# Altium project MOD-COIL-LN2-21.PrjPCB (part 2 of 4)

## Sheet CPLD.SchDoc: =Project
size 420 x 297 mm; Author: G.Kasprowicz; CompanyName: WUT ISE; DrawnBy: G.Kasprowicz; Organization: WUT ISE; Address1: PW ISE; Address2: Nowowiejska 15/19 00-665 Warsaw; Address3: gkasprow@gmail.com; SheetNumber: 2; SheetTotal: 9; ModifiedBy: -; CheckedDate: -; Title2: CPLD; DivGrp: WUT ISE; Designer: G.Kasprowicz; SPICEModelCacheRYPVXPCY: <root> / <DocumentId>RYPVXPCY</DocumentId> / </root>; ModifiedDate: -; ProjectName: Sensor Box
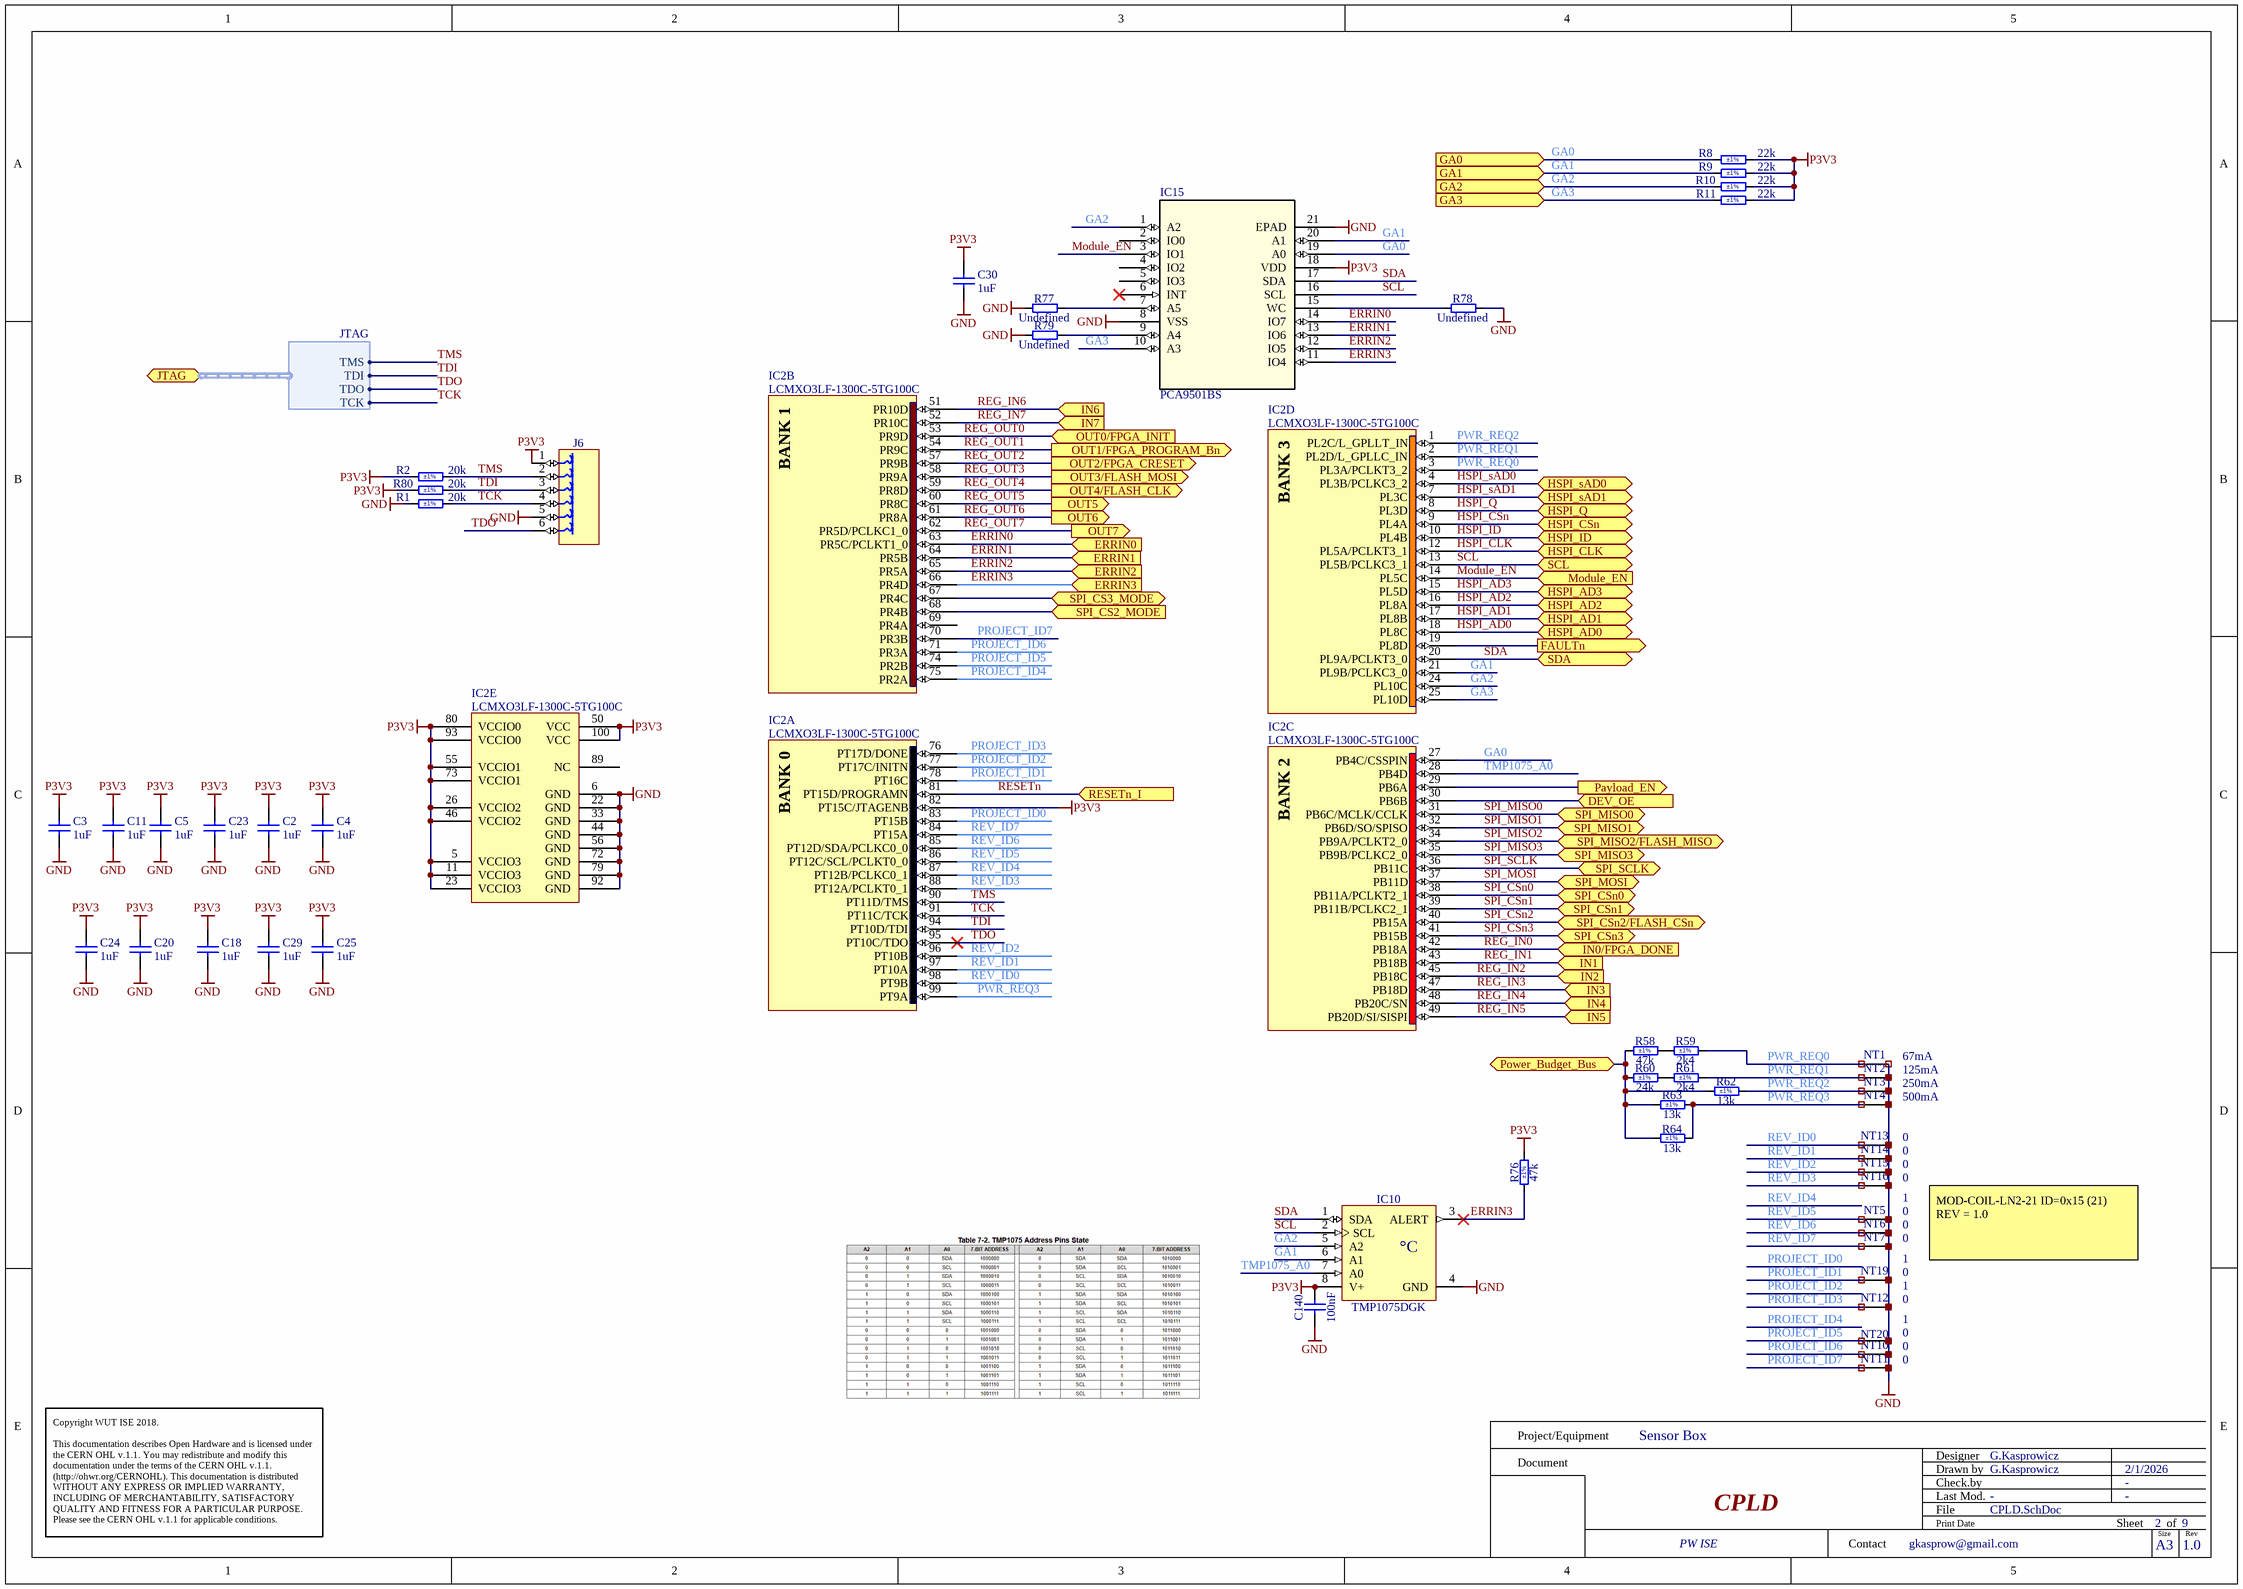
[diagram p2: CPLD.SchDoc]

### Parts
C2  1uF  [CAPC1005X55N]
C3  1uF  [CAPC1005X55N]
C4  1uF  [CAPC1005X55N]
C5  1uF  [CAPC1005X55N]
C11  1uF  [CAPC1005X55N]
C18  1uF  [CAPC1005X55N]
C20  1uF  [CAPC1005X55N]
C23  1uF  [CAPC1005X55N]
C24  1uF  [CAPC1005X55N]
C25  1uF  [CAPC1005X55N]
C29  1uF  [CAPC1005X55N]
C30  1uF  [CAPC1005X55N]
C140  100nF  [CAPC1005X55N]
IC2  LCMXO3LF-1300C-5TG100C  [QFP50P1600X1600X160-100N]  (parts A,B,C,D,E of 5)
IC10  TMP1075DGK  [SOP65P490X110-8N]
IC15  PCA9501BS  [HVQFN20_SOT662-1_5X5_NXP]
J6  TC2030-MCP  [TC2030-MCP]  (value not drawn)  (no BOM)
NT1  Net Tie  [Net Tie 3]  (value not drawn)  (net tie, no BOM)
NT2  Net Tie  [Net Tie 3]  (value not drawn)  (net tie, no BOM)
NT3  Net Tie  [Net Tie 3]  (value not drawn)  (net tie, no BOM)
NT4  Net Tie  [Net Tie 3]  (value not drawn)  (net tie, no BOM)
NT5  Net Tie  [Net Tie 3]  (value not drawn)  (net tie, no BOM)
NT6  Net Tie  [Net Tie 3]  (value not drawn)  (net tie, no BOM)
NT7  Net Tie  [Net Tie 3]  (value not drawn)  (net tie, no BOM)
NT10  Net Tie  [Net Tie 3]  (value not drawn)  (net tie, no BOM)
NT11  Net Tie  [Net Tie 3]  (value not drawn)  (net tie, no BOM)
NT12  Net Tie  [Net Tie 3]  (value not drawn)  (net tie, no BOM)
NT13  Net Tie  [Net Tie 3]  (value not drawn)  (net tie, no BOM)
NT14  Net Tie  [Net Tie 3]  (value not drawn)  (net tie, no BOM)
NT15  Net Tie  [Net Tie 3]  (value not drawn)  (net tie, no BOM)
NT16  Net Tie  [Net Tie 3]  (value not drawn)  (net tie, no BOM)
NT19  Net Tie  [Net Tie 3]  (value not drawn)  (net tie, no BOM)
NT20  Net Tie  [Net Tie 3]  (value not drawn)  (net tie, no BOM)
R1  20k  Tolerance: ±1%  [RESC1005X40N]
R2  20k  Tolerance: ±1%  [RESC1005X40N]
R8  22k  Tolerance: ±1%  [RESC1005X40N]
R9  22k  Tolerance: ±1%  [RESC1005X40N]
R10  22k  Tolerance: ±1%  [RESC1005X40N]
R11  22k  Tolerance: ±1%  [RESC1005X40N]
R58  47k  Tolerance: ±1%  [RESC1005X40N]
R59  2k4  Tolerance: ±1%  [RESC1005X40N]
R60  24k  Tolerance: ±1%  [RESC1005X40N]
R61  2k4  Tolerance: ±1%  [RESC1005X40N]
R62  13k  Tolerance: ±1%  [RESC1005X40N]
R63  13k  Tolerance: ±1%  [RESC1005X40N]
R64  13k  Tolerance: ±1%  [RESC1005X40N]
R76  47k  Tolerance: ±1%  [RESC1005X40N]
R77  Undefined  [RESC1005X40N]
R78  Undefined  [RESC1005X40N]
R79  Undefined  [RESC1005X40N]
R80  20k  Tolerance: ±1%  [RESC1005X40N]

### Ports
DEV_OE (in), ERRIN0 (in), ERRIN1 (in), ERRIN2 (in), ERRIN3 (in), FAULTn (out), GA0 (in), GA1 (in), GA2 (in), GA3 (in), HSPI_AD0 (bidir), HSPI_AD1 (bidir), HSPI_AD2 (bidir), HSPI_AD3 (bidir), HSPI_CLK (bidir), HSPI_CSn (bidir), HSPI_ID (bidir), HSPI_Q (bidir), HSPI_sAD0 (bidir), HSPI_sAD1 (bidir), IN0/FPGA_DONE (in), IN1 (in), IN2 (in), IN3 (in), IN4 (in), IN5 (in), IN6 (in), IN7 (in), JTAG (bidir, harness JTAG), Module_EN (in), OUT0/FPGA_INIT (in), OUT1/FPGA_PROGRAM_Bn (out), OUT2/FPGA_CRESET (out), OUT3/FLASH_MOSI (out), OUT4/FLASH_CLK (out), OUT5 (out), OUT6 (out), OUT7 (out), Payload_EN (out), Power_Budget_Bus (bidir), RESETn_I (in), SCL (bidir), SDA (bidir), SPI_CS2_MODE (in), SPI_CS3_MODE (bidir), SPI_CSn0 (bidir), SPI_CSn1 (bidir), SPI_CSn2/FLASH_CSn (bidir), SPI_CSn3 (bidir), SPI_MISO0 (bidir), SPI_MISO1 (bidir), SPI_MISO2/FLASH_MISO (bidir), SPI_MISO3 (bidir), SPI_MOSI (bidir), SPI_SCLK (bidir)

### Harnesses
JTAG: TMS, TDI, TDO, TCK

### Nets
GND: C2.1 C3.1 C4.1 C5.1 C11.1 C18.1 C20.1 C23.1 C24.1 C25.1 C29.1 C30.1 C140.1 IC2.6(GND) IC2.22(GND) IC2.33(GND) IC2.44(GND) IC2.56(GND) IC2.72(GND) IC2.79(GND) IC2.92(GND) IC10.4(GND) IC15.8(VSS) IC15.21(EPAD) J6.5 NT1.2 NT2.2 NT3.2 NT4.2 NT5.2 NT6.2 NT7.2 NT10.2 NT11.2 NT12.2 NT13.2 NT14.2 NT15.2 NT16.2 NT19.2 NT20.2 R1.2 R77.1 R78.2 R79.1
P3V3: C2.2 C3.2 C4.2 C5.2 C11.2 C18.2 C20.2 C23.2 C24.2 C25.2 C29.2 C30.2 C140.2 IC2.5(VCCIO3) IC2.11(VCCIO3) IC2.23(VCCIO3) IC2.26(VCCIO2) IC2.46(VCCIO2) IC2.50(VCC) IC2.55(VCCIO1) IC2.73(VCCIO1) IC2.80(VCCIO0) IC2.82(PT15C/JTAGENB) IC2.93(VCCIO0) IC2.100(VCC) IC10.8(V+) IC15.18(VDD) J6.1 R2.2 R8.1 R9.1 R10.1 R11.1 R76.2 R80.2
ERRIN0: IC2.63(PR5C/PCLKT1_0) IC15.14(IO7) ; port ERRIN0  [project net CH0_BOOST_FLT]
ERRIN1: IC2.64(PR5B) IC15.13(IO6) ; port ERRIN1  [project net CH1_BOOST_FLT]
ERRIN2: IC2.65(PR5A) IC15.12(IO5) ; port ERRIN2  [project net CH0_ERR]
ERRIN3: IC2.66(PR4D) IC10.3(ALERT) IC15.11(IO4) R76.1 ; port ERRIN3  [project net CH1_ERR]
FAULTn: IC2.19(PL8D) ; port FAULTn
GA0: IC2.27(PB4C/CSSPIN) IC15.19(A0) R8.2 ; port GA0
GA1: IC2.21(PL9B/PCLKC3_0) IC10.6(A1) IC15.20(A1) R9.2 ; port GA1
GA2: IC2.24(PL10C) IC10.5(A2) IC15.1(A2) R10.2 ; port GA2
GA3: IC2.25(PL10D) IC15.10(A3) R11.2 ; port GA3
HSPI_AD0: IC2.18(PL8C) ; port HSPI_AD0
HSPI_AD1: IC2.17(PL8B) ; port HSPI_AD1
HSPI_AD2: IC2.16(PL8A) ; port HSPI_AD2
HSPI_AD3: IC2.15(PL5D) ; port HSPI_AD3
HSPI_CLK: IC2.12(PL5A/PCLKT3_1) ; port HSPI_CLK
HSPI_CSn: IC2.9(PL4A) ; port HSPI_CSn
HSPI_ID: IC2.10(PL4B) ; port HSPI_ID
HSPI_Q: IC2.8(PL3D) ; port HSPI_Q
HSPI_sAD0: IC2.4(PL3B/PCLKC3_2) ; port HSPI_sAD0
HSPI_sAD1: IC2.7(PL3C) ; port HSPI_sAD1
Module_EN: IC2.14(PL5C) IC15.3(IO1) ; port Module_EN
Payload_EN: IC2.29(PB6A) ; port Payload_EN
PROJECT_ID0: IC2.83(PT15B)
PROJECT_ID1: IC2.78(PT16C) NT19.1
PROJECT_ID2: IC2.77(PT17C/INITN)
PROJECT_ID3: IC2.76(PT17D/DONE) NT12.1
PROJECT_ID4: IC2.75(PR2A)
PROJECT_ID5: IC2.74(PR2B) NT20.1
PROJECT_ID6: IC2.71(PR3A) NT10.1
PROJECT_ID7: IC2.70(PR3B) NT11.1
PWR_REQ0: IC2.3(PL3A/PCLKT3_2) NT1.1 R59.2
PWR_REQ1: IC2.2(PL2D/L_GPLLC_IN) NT2.1 R61.2
PWR_REQ2: IC2.1(PL2C/L_GPLLT_IN) NT3.1 R62.2
PWR_REQ3: IC2.99(PT9A) NT4.1 R63.2 R64.2
REG_IN0: IC2.42(PB18A) ; port IN0/FPGA_DONE
REG_IN1: IC2.43(PB18B) ; port IN1
REG_IN2: IC2.45(PB18C) ; port IN2
REG_IN3: IC2.47(PB18D) ; port IN3
REG_IN4: IC2.48(PB20C/SN) ; port IN4
REG_IN5: IC2.49(PB20D/SI/SISPI) ; port IN5
REG_IN6: IC2.51(PR10D) ; port IN6
REG_IN7: IC2.52(PR10C) ; port IN7
REG_OUT0: IC2.53(PR9D) ; port OUT0/FPGA_INIT
REG_OUT1: IC2.54(PR9C) ; port OUT1/FPGA_PROGRAM_Bn
REG_OUT2: IC2.57(PR9B) ; port OUT2/FPGA_CRESET
REG_OUT3: IC2.58(PR9A) ; port OUT3/FLASH_MOSI
REG_OUT4: IC2.59(PR8D) ; port OUT4/FLASH_CLK  [project net LED0]
REG_OUT5: IC2.60(PR8C) ; port OUT5  [project net LED1]
REG_OUT6: IC2.61(PR8A) ; port OUT6  [project net LED2]
REG_OUT7: IC2.62(PR5D/PCLKC1_0) ; port OUT7  [project net LED3]
RESETn: IC2.81(PT15D/PROGRAMN) ; port RESETn_I
REV_ID0: IC2.98(PT9B) NT13.1
REV_ID1: IC2.97(PT10A) NT14.1
REV_ID2: IC2.96(PT10B) NT15.1
REV_ID3: IC2.88(PT12A/PCLKT0_1) NT16.1
REV_ID4: IC2.87(PT12B/PCLKC0_1)
REV_ID5: IC2.86(PT12C/SCL/PCLKT0_0) NT5.1
REV_ID6: IC2.85(PT12D/SDA/PCLKC0_0) NT6.1
REV_ID7: IC2.84(PT15A) NT7.1
SCL: IC2.13(PL5B/PCLKC3_1) IC10.2(SCL) IC15.16(SCL) ; port SCL
SDA: IC2.20(PL9A/PCLKT3_0) IC10.1(SDA) IC15.17(SDA) ; port SDA
SPI_CSn0: IC2.38(PB11A/PCLKT2_1) ; port SPI_CSn0
SPI_CSn1: IC2.39(PB11B/PCLKC2_1) ; port SPI_CSn1
SPI_CSn2: IC2.40(PB15A) ; port SPI_CSn2/FLASH_CSn
SPI_CSn3: IC2.41(PB15B) ; port SPI_CSn3  [project net PWRMON_SPI_CSn]
SPI_MISO0: IC2.31(PB6C/MCLK/CCLK) ; port SPI_MISO0
SPI_MISO1: IC2.32(PB6D/SO/SPISO) ; port SPI_MISO1
SPI_MISO2: IC2.34(PB9A/PCLKT2_0) ; port SPI_MISO2/FLASH_MISO
SPI_MISO3: IC2.35(PB9B/PCLKC2_0) ; port SPI_MISO3  [project net PWRMON_SPI_Q]
SPI_MOSI: IC2.37(PB11D) ; port SPI_MOSI
SPI_SCLK: IC2.36(PB11C) ; port SPI_SCLK  [project net SPI_CLK]
TCK: IC2.91(PT11C/TCK) J6.4 R1.1 ; port JTAG.TCK
TDI: IC2.94(PT10D/TDI) J6.3 R80.1 ; port JTAG.TDI
TDO: IC2.95(PT10C/TDO) J6.6 ; port JTAG.TDO
TMP1075_A0: IC2.28(PB4D) IC10.7(A0)
TMS: IC2.90(PT11D/TMS) J6.2 R2.1 ; port JTAG.TMS
NetIC2_30: IC2.30(PB6B) ; port DEV_OE
NetIC2_67: IC2.67(PR4C) ; port SPI_CS3_MODE
NetIC2_68: IC2.68(PR4B) ; port SPI_CS2_MODE
NetIC15_7: IC15.7(A5) R77.2
NetIC15_9: IC15.9(A4) R79.2
NetIC15_15: IC15.15(WC) R78.1
NetJ1_B17: R58.1 R60.1 R62.1 R63.1 R64.1 ; port Power_Budget_Bus
NetR58_2: R58.2 R59.1
NetR60_2: R60.2 R61.1

Not connected (* = marked no-connect by the designer): IC2 69(PR4A) 89(NC); IC15 2(IO0) 4(IO2) 5(IO3) 6(INT)*

### Notes on the sheet
- 125mA
- 67mA
- 500mA
- 250mA
- 0
- 1
- MOD-COIL-LN2-21 ID=0x15 (21)
  REV = 1.0
- Project/Equipment
- Document
- Designer
- Drawn by
- Check.by
- Copyright WUT ISE 2018.
  This documentation describes Open Hardware and is licensed under the CERN OHL v.1.1. You may redistribute and modify this documentation under the terms of the CERN OHL v.1.1. (http://ohwr.org/CERNOHL). This documentation is distributed WITHOUT ANY EXPRESS OR IMPLIED WARRANTY, INCLUDING OF MERCHANTABILITY, SATISFACTORY QUALITY AND FITNESS FOR A PARTICULAR PURPOSE. Please see the CERN OHL v.1.1 for applicable conditions.
- Contact
- File
- Last Mod.
- Print Date
- Sheet
- Size
- A3
- of
- Rev
- (in symbol LCMXO3LF-1300C-5TG100C, part A) BANK 0
- (in symbol LCMXO3LF-1300C-5TG100C, part B) BANK 1
- (in symbol LCMXO3LF-1300C-5TG100C, part C) BANK 2
- (in symbol LCMXO3LF-1300C-5TG100C, part D) BANK 3
- (in symbol TMP1075DGK) °C

### Library data of the parts
C2-C5 C11 C18 C20 C23-C25 C29 C30 = CC0402_1UF_16V_10%_X5R: Non-polarised capacitor; Part Description: SMD Multilayer Chip Ceramic Capacitor; Manufacturer: GENERIC; Manufacturer1 Part Number: C1005X5R1C105KT; Voltage: 16V; TC: X5R; Tolerance: ±10%; Part Number: CC0402_1UF_16V_10%_X5R; Component Kind: Standard; Component Type: Standard; Pin Count: 2; Value: 1uF; Status: Preferred; Manufacturer Part Number: CC0402_1UF_16V_10%_X5R; Case: 0402; Mounted: Yes; Socket: No; SMD: Yes; Sense: No; Manufacturer1 Example: TDK; Manufacturer1 ComponentHeight: 0.55mm; HelpURL: \\cern.ch\dfs\Applications\Altium\Datasheets\CC0402_X5R_TDK_C.pdf; Author: CERN DEM JLC; CreateDate: 25.10.2012; LatestRevisionDate: 25.10.2012
C140 = CC0402_100NF_16V_10%_X7R: Non-polarised capacitor; Part Description: SMD Multilayer Chip Ceramic Capacitor; Manufacturer: GENERIC; Manufacturer1 Part Number: GRM155R71C104KA88D; Voltage: 16V; TC: X7R; Tolerance: ±10%; Part Number: CC0402_100NF_16V_10%_X7R; Component Kind: Standard; Component Type: Standard; Pin Count: 2; Value: 100nF; Status: Not Recommended; Manufacturer Part Number: CC0402_100NF_16V_10%_X7R; Case: 0402; Mounted: Yes; Socket: No; SMD: Yes; Sense: No; Manufacturer1 Example: MURATA; Manufacturer1 ComponentHeight: 0.55mm; HelpURL: \\cern.ch\dfs\Applications\Altium\Datasheets\CC0402_X7R_MURATA_GRM.pdf; Author: CERN DEM JLC; CreateDate: 05.12.2013; LatestRevisionDate: 03.12.2007
IC2 = LCMXO3LF-1300C-5TG100C: MachXO2, 2.5V/3.3V High-Performance 2000 Macrocell CPLD, 80 I/Os, 100-Pin TQFP, Speed Grade 4, Industrial Grade; Part Description: MachXO3LF, 2.5V/3.3V Low-Density Ultra-Low Power FPGA, 1300 LUTs, 80 I/Os, 100-Pin TQFP, Speed Grade 5, Commercial Grade; Manufacturer: LATTICE SEMICONDUCTOR; PressFit: No; Bonding: No; Part Number: LCMXO3LF-1300C-5TG100C; Component Kind: Standard; Component Type: Standard; Device: LCMXO3LF-1300C-5TG100C; PackageDescription: QFP, 0.50mm Pitch, Square; 100 Pin, 14.0mm L X 14.0mm W X 1.60mm H body, IPC Medium Density; Manufacturer Part Number: LCMXO3LF-1300C-5TG100C; Pin Count: 100; Case: QFP100; Mounted: Yes; Socket: No; SMD: Yes; Sense: No; ComponentHeight: 1.6mm; HelpURL: \\cern.ch\dfs\Applications\Altium\Datasheets\LCMXO3LF_Serie.pdf; ComponentLink1URL: \\cern.ch\dfs\Applications\Altium\Datasheets\LATTICE_Package.pdf; ComponentLink1Description: Package Drawing; ComponentLink2URL: \\cern.ch\dfs\Applications\Altium\Datasheets\LCMXO3LF-1300C-5TG100_Pinout.pdf; ComponentLink2Description: Pinout; Author: CERN DEM MR; CreateDate: 18.06.2019; LatestRevisionDate: 18.06.2019
IC10 = TMP1075DGK: High Accuracy Temperature Sensor With I2C and SMBus Interface in Industry Standard LM75; Manufacturer: TEXAS INSTRUMENTS; PressFit: No; Bonding: No; Part Number: TMP1075DGK; Component Kind: Standard; Component Type: Standard; Device: TMP1075DGK; PackageDescription: SOP, 0.65mm Pitch; 8 Pin, 3.00mm W X 3.00mm L X 1.10mm H body, IPC Medium Density; Part Description: High Accuracy Temperature Sensor with I2C and SMBus Interface in Industry Standard LM75; Manufacturer Part Number: TMP1075DGK; Pin Count: 8; Case: uSOP8; Mounted: Yes; Socket: No; SMD: Yes; Sense: No; ComponentHeight: 1.1mm; HelpURL: \\cern.ch\dfs\Applications\Altium\Datasheets\TMP1075DGK.pdf; Author: CERN DEM MR; CreateDate: 04.10.2019; LatestRevisionDate: 04.10.2019
IC15 = IFC_PCA9501BS: 8-bit I2C-bus and SMBus I/O port with interrupt, 2-kbit / EEPROM and 6 address pins; Manufacturer: NXP; Manufacturer Part Number: PCA9501BS,118; Part Number: PCA9501BS
J6 = TC2030-MCP: TC2030-MCP and TC2030-MCP-NL Pad Contact; Part Description: 6 X 31mil Diameter SMD Pad For TC2030-MCP Legged Connector; Mounted: No; Part Number: TC2030-MCP; Component Type: Standard (No BOM); Pin Count: 6; Family: TC2030-MCP; Socket: No; SMD: Yes; Sense: No; Status: None; ComponentHeight: 0mm; HelpURL: \\cern.ch\dfs\Applications\Altium\Datasheets\TC2030-MCP.pdf; Author: CERN DEM HF; CreateDate: 27.03.2023; LatestRevisionDate: 27.03.2023; PackageDescription: 6 X 31mil Diameter SMD Pad For TC2030-MCP Legged Connector
NT1-NT7 NT10-NT16 NT19 NT20 = Net Tie 3: Part Description: Net Tie (2 Nets); Mounted: No; Part Number: Net Tie 3; Component Type: Net Tie; Pin Count: 2; Family: Net Tie; Socket: No; SMD: No; Sense: No; Status: None; ComponentHeight: 0mm; HelpURL: Undefined; Author: CERN DEM HF; CreateDate: 23.09.2024; LatestRevisionDate: 23.09.2024; PackageDescription: SMD Net Tie
R1 R2 R80 = R0402_20K_1%_0.0625W_100PPM: Resistor - 1%; Part Description: General Purpose Thick Film Chip Resistor; Manufacturer: GENERIC; Manufacturer1 Part Number: 232270672003L; TC: ±100ppm/°C; PressFit: No; Part Number: R0402_20K_1%_0.0625W_100PPM; Component Kind: Standard; Component Type: Standard; Pin Count: 2; Value: 20k; Status: Not Recommended; Power: 0.0625W; Manufacturer Part Number: R0402_20K_1%_0.0625W_100PPM; Case: 0402; Mounted: Yes; Sense: No; Socket: No; SMD: Yes; Manufacturer1 Example: YAGEO PHYCOMP; Manufacturer1 ComponentHeight: 0.4mm; HelpURL: \\cern.ch\dfs\Applications\Altium\Datasheets\R0402_Phycomp_RC0402.pdf; Author: CERN DEM JLC; CreateDate: 03.12.2007; LatestRevisionDate: 17.10.2012
R8-R11 = R0402_22K_1%_0.0625W_100PPM: Resistor - 1%; Part Description: General Purpose Thick Film Chip Resistor; Manufacturer: GENERIC; Manufacturer1 Part Number: 232270672203L; TC: ±100ppm/°C; PressFit: No; Part Number: R0402_22K_1%_0.0625W_100PPM; Component Kind: Standard; Component Type: Standard; Pin Count: 2; Value: 22k; Status: Not Recommended; Power: 0.0625W; Manufacturer Part Number: R0402_22K_1%_0.0625W_100PPM; Case: 0402; Mounted: Yes; Sense: No; Socket: No; SMD: Yes; Manufacturer1 Example: YAGEO PHYCOMP; Manufacturer1 ComponentHeight: 0.4mm; HelpURL: \\cern.ch\dfs\Applications\Altium\Datasheets\R0402_Phycomp_RC0402.pdf; Author: CERN DEM JLC; CreateDate: 03.12.2007; LatestRevisionDate: 17.10.2012
R58 R76 = R0402_47K_1%_0.0625W_100PPM: Resistor - 1%; Part Description: General Purpose Thick Film Chip Resistor; Manufacturer: GENERIC; Manufacturer1 Part Number: 232270674703L; TC: ±100ppm/°C; PressFit: No; Part Number: R0402_47K_1%_0.0625W_100PPM; Component Kind: Standard; Component Type: Standard; Pin Count: 2; Value: 47k; Status: Not Recommended; Power: 0.0625W; Manufacturer Part Number: R0402_47K_1%_0.0625W_100PPM; Case: 0402; Mounted: Yes; Sense: No; Socket: No; SMD: Yes; Manufacturer1 Example: YAGEO PHYCOMP; Manufacturer1 ComponentHeight: 0.4mm; HelpURL: \\cern.ch\dfs\Applications\Altium\Datasheets\R0402_Phycomp_RC0402.pdf; Author: CERN DEM JLC; CreateDate: 03.12.2007; LatestRevisionDate: 17.10.2012
R59 R61 = R0402_2K4_1%_0.0625W_100PPM: Resistor - 1%; Part Description: General Purpose Thick Film Chip Resistor; Manufacturer: GENERIC; Manufacturer1 Part Number: 232270672402L; TC: ±100ppm/°C; PressFit: No; Part Number: R0402_2K4_1%_0.0625W_100PPM; Component Kind: Standard; Component Type: Standard; Pin Count: 2; Value: 2k4; Status: Not Recommended; Power: 0.0625W; Manufacturer Part Number: R0402_2K4_1%_0.0625W_100PPM; Case: 0402; Mounted: Yes; Sense: No; Socket: No; SMD: Yes; Manufacturer1 Example: YAGEO PHYCOMP; Manufacturer1 ComponentHeight: 0.4mm; HelpURL: \\cern.ch\dfs\Applications\Altium\Datasheets\R0402_Phycomp_RC0402.pdf; Author: CERN DEM JLC; CreateDate: 03.12.2007; LatestRevisionDate: 17.10.2012
R60 = R0402_24K_1%_0.0625W_100PPM: Resistor - 1%; Part Description: General Purpose Thick Film Chip Resistor; Manufacturer: GENERIC; Manufacturer1 Part Number: 232270672403L; TC: ±100ppm/°C; PressFit: No; Part Number: R0402_24K_1%_0.0625W_100PPM; Component Kind: Standard; Component Type: Standard; Pin Count: 2; Value: 24k; Status: Not Recommended; Power: 0.0625W; Manufacturer Part Number: R0402_24K_1%_0.0625W_100PPM; Case: 0402; Mounted: Yes; Sense: No; Socket: No; SMD: Yes; Manufacturer1 Example: YAGEO PHYCOMP; Manufacturer1 ComponentHeight: 0.4mm; HelpURL: \\cern.ch\dfs\Applications\Altium\Datasheets\R0402_Phycomp_RC0402.pdf; Author: CERN DEM JLC; CreateDate: 03.12.2007; LatestRevisionDate: 17.10.2012
R62-R64 = R0402_13K_1%_0.0625W_100PPM: Resistor - 1%; Part Description: General Purpose Thick Film Chip Resistor; Manufacturer: GENERIC; Manufacturer1 Part Number: 232270671303L; TC: ±100ppm/°C; PressFit: No; Part Number: R0402_13K_1%_0.0625W_100PPM; Component Kind: Standard; Component Type: Standard; Pin Count: 2; Value: 13k; Status: Not Recommended; Power: 0.0625W; Manufacturer Part Number: R0402_13K_1%_0.0625W_100PPM; Case: 0402; Mounted: Yes; Sense: No; Socket: No; SMD: Yes; Manufacturer1 Example: YAGEO PHYCOMP; Manufacturer1 ComponentHeight: 0.4mm; HelpURL: \\cern.ch\dfs\Applications\Altium\Datasheets\R0402_Phycomp_RC0402.pdf; Author: CERN DEM JLC; CreateDate: 03.12.2007; LatestRevisionDate: 17.10.2012
R77-R79 = R0402_NO-VALUE: Resistor; Part Description: Reserved Footprint For a 0402 (1005) Chip Resistor; PressFit: No; Mounted: No; Part Number: R0402_NO-VALUE; Component Kind: Standard; Component Type: Standard; Pin Count: 2; Value: Undefined; Status: None; Manufacturer: Undefined; Manufacturer Part Number: R0402_NO-VALUE; Case: 0402; Sense: No; Socket: No; SMD: Yes; Manufacturer1 Example: Undefined; Manufacturer1 Part Number: Undefined; Manufacturer1 ComponentHeight: Undefined; HelpURL: Undefined; Author: CERN DEM JLC; CreateDate: 03.12.2007; LatestRevisionDate: 13.03.2008

## Sheet FPGA.SchDoc: FPGA
size A3; Author: M.Beldyga; CompanyName: WUT ISE; DrawnBy: M.Beldyga; Organization: WUT ISE; Address1: PW ISE; Address2: Nowowiejska 15/19 00-665 Warsaw; Address3: micbeldyga@gmail.com; SheetNumber: 4; SheetTotal: 9; ModifiedBy: -; CheckedDate: -; DivGrp: WUT ISE; Designer: M.Beldyga; ModifiedDate: -; ProjectName: Sensor Box
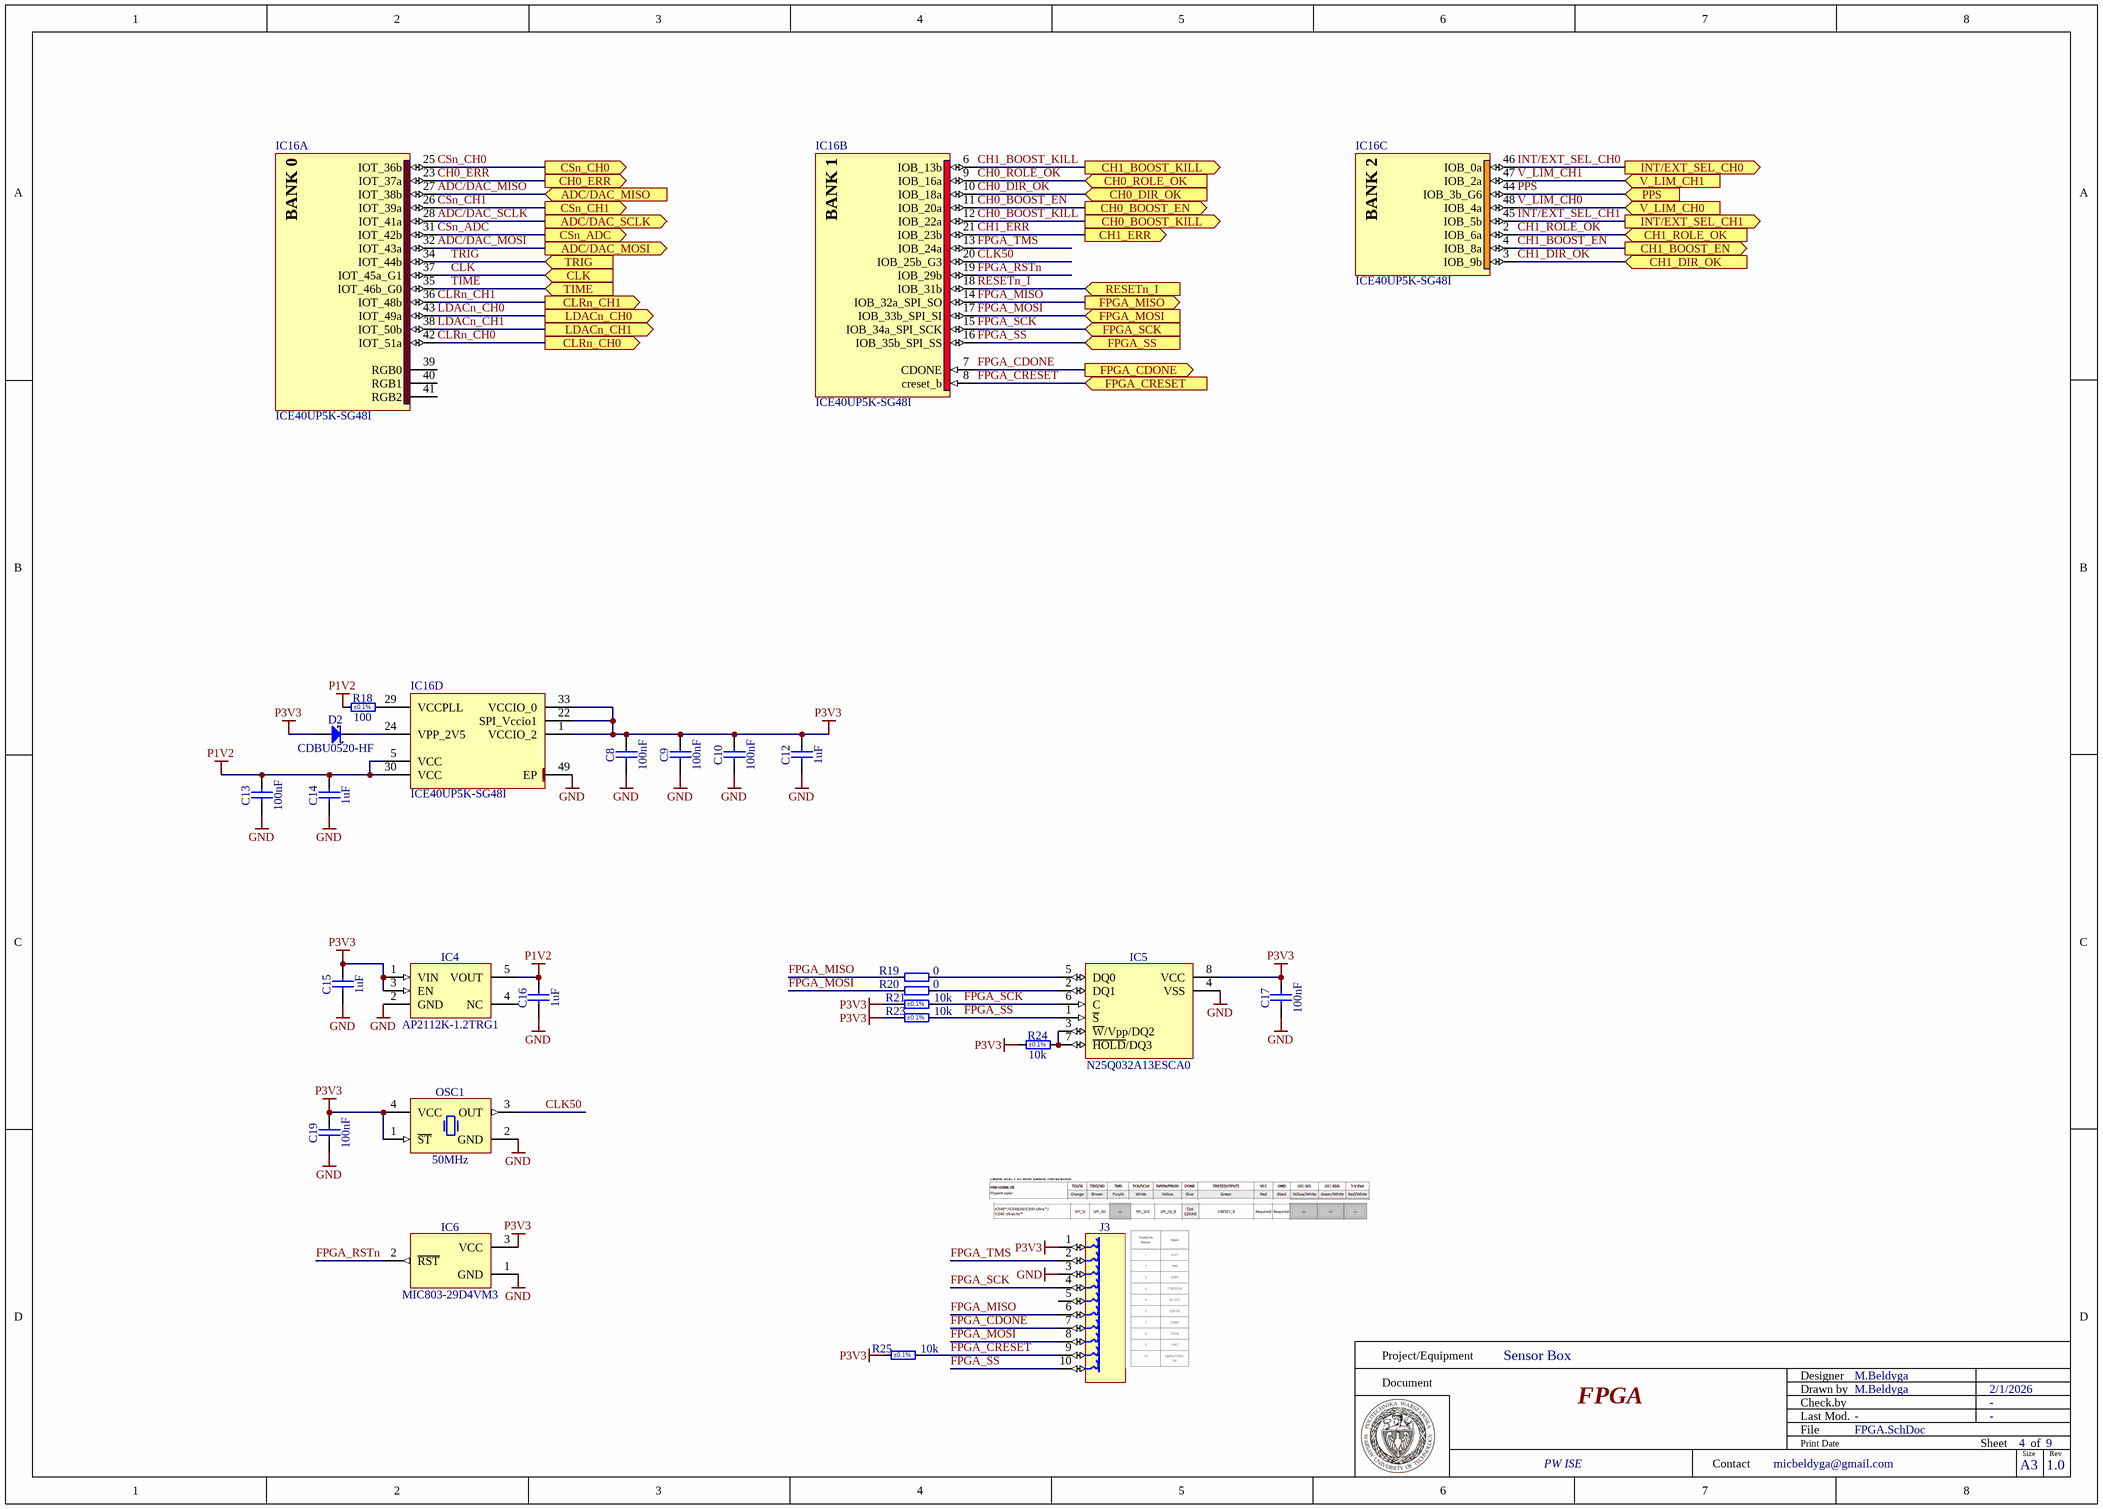
[diagram p3: FPGA.SchDoc]

### Parts
C8  100nF  [CAPC1005X55N]
C9  100nF  [CAPC1005X55N]
C10  100nF  [CAPC1005X55N]
C12  1uF  [CAPC1005X55N]
C13  100nF  [CAPC1005X55N]
C14  1uF  [CAPC1005X55N]
C15  1uF  [CAPC1005X55N]
C16  1uF  [CAPC1005X55N]
C17  100nF  [CAPC1005X55N]
C19  100nF  [CAPC1005X55N]
D2  CDBU0520-HF  [SOD-523F]
IC4  AP2112K-1.2TRG1  [SOT95P285X140-5N]
IC5  N25Q032A13ESCA0  [SOIC127P600X175-8N]
IC6  MIC803-29D4VM3  [SOT95P237X112-3N]
IC16  ICE40UP5K-SG48I  [QFN50P700X700X100-49N-S550]  (parts A,B,C,D of 4)
J3  TC2050-IDC  [TC2050-IDC]  (value not drawn)
OSC1  50MHz  [OSC_EPSON_SG-310]
R18  100  Tolerance: ±0.1%  [RESC1005X35N]
R19  0  [RESC1005X40N]
R20  0  [RESC1005X40N]
R21  10k  Tolerance: ±0.1%  [RESC1005X35N]
R23  10k  Tolerance: ±0.1%  [RESC1005X35N]
R24  10k  Tolerance: ±0.1%  [RESC1005X35N]
R25  10k  Tolerance: ±0.1%  [RESC1005X35N]

### Ports
ADC/DAC_MISO (in), ADC/DAC_MOSI (out), ADC/DAC_SCLK (out), CH0_BOOST_EN (out), CH0_BOOST_KILL (out), CH0_DIR_OK (in), CH0_ERR (out), CH0_ROLE_OK (in), CH1_BOOST_EN (out), CH1_BOOST_KILL (out), CH1_DIR_OK (in), CH1_ERR (out), CH1_ROLE_OK (in), CLK (in), CLRn_CH0 (out), CLRn_CH1 (out), CSn_ADC (out), CSn_CH0 (out), CSn_CH1 (out), FPGA_CDONE (out), FPGA_CRESET (in), FPGA_MISO (out), FPGA_MOSI (in), FPGA_SCK (in), FPGA_SS (in), INT/EXT_SEL_CH0 (out), INT/EXT_SEL_CH1 (out), LDACn_CH0 (out), LDACn_CH1 (out), PPS (in), RESETn_I (in), TIME (in), TRIG (in), V_LIM_CH0 (in), V_LIM_CH1 (in)

### Nets
GND: C8.1 C9.1 C10.1 C12.1 C13.1 C14.1 C15.1 C16.1 C17.1 C19.1 IC4.2(GND) IC5.4(VSS) IC6.1(GND) IC16.49(EP) J3.3 OSC1.2(GND)
P1V2: C13.2 C14.2 C16.2 IC4.5(VOUT) IC16.5(VCC) IC16.30(VCC) R18.1
P3V3: C8.2 C9.2 C10.2 C12.2 C15.2 C17.2 C19.2 D2.2(A) IC4.1(VIN) IC4.3(EN) IC5.8(VCC) IC6.3(VCC) IC16.1(VCCIO_2) IC16.22(SPI_Vccio1) IC16.33(VCCIO_0) J3.1 OSC1.1(~{ST}) OSC1.4(VCC) R21.1 R23.1 R24.1 R25.1
ADC/DAC_MISO: IC16.27(IOT_38b) ; port ADC/DAC_MISO
ADC/DAC_MOSI: IC16.32(IOT_43a) ; port ADC/DAC_MOSI
ADC/DAC_SCLK: IC16.28(IOT_41a) ; port ADC/DAC_SCLK
CH0_BOOST_EN: IC16.11(IOB_20a) ; port CH0_BOOST_EN  [project net BOOSTER_EN]
CH0_BOOST_KILL: IC16.12(IOB_22a) ; port CH0_BOOST_KILL  [project net BOOSTER_KILL]
CH0_DIR_OK: IC16.10(IOB_18a) ; port CH0_DIR_OK
CH0_ERR: IC16.23(IOT_37a) ; port CH0_ERR
CH0_ROLE_OK: IC16.9(IOB_16a) ; port CH0_ROLE_OK
CH1_BOOST_EN: IC16.4(IOB_8a) ; port CH1_BOOST_EN  [project net BOOSTER_EN]
CH1_BOOST_KILL: IC16.6(IOB_13b) ; port CH1_BOOST_KILL  [project net BOOSTER_KILL]
CH1_DIR_OK: IC16.3(IOB_9b) ; port CH1_DIR_OK
CH1_ERR: IC16.21(IOB_23b) ; port CH1_ERR
CH1_ROLE_OK: IC16.2(IOB_6a) ; port CH1_ROLE_OK
CLK: IC16.37(IOT_45a_G1) ; port CLK
CLK50: IC16.20(IOB_25b_G3) OSC1.3(OUT)
CLRn_CH0: IC16.42(IOT_51a) ; port CLRn_CH0  [project net CLRn_0]
CLRn_CH1: IC16.36(IOT_48b) ; port CLRn_CH1  [project net CLRn_1]
CSn_ADC: IC16.31(IOT_42b) ; port CSn_ADC  [project net CSn_2]
CSn_CH0: IC16.25(IOT_36b) ; port CSn_CH0  [project net CSn_0]
CSn_CH1: IC16.26(IOT_39a) ; port CSn_CH1  [project net CSn_1]
FPGA_CDONE: IC16.7(CDONE) J3.7 ; port FPGA_CDONE
FPGA_CRESET: IC16.8(creset_b) J3.9 R25.2 ; port FPGA_CRESET
FPGA_MISO: IC16.14(IOB_32a_SPI_SO) J3.6 R19.1 ; port FPGA_MISO
FPGA_MOSI: IC16.17(IOB_33b_SPI_SI) J3.8 R20.1 ; port FPGA_MOSI
FPGA_RSTn: IC6.2(~{RST}) IC16.19(IOB_29b)
FPGA_SCK: IC5.6(C) IC16.15(IOB_34a_SPI_SCK) J3.4 R21.2 ; port FPGA_SCK
FPGA_SS: IC5.1(~{S}) IC16.16(IOB_35b_SPI_SS) J3.10 R23.2 ; port FPGA_SS
FPGA_TMS: IC16.13(IOB_24a) J3.2
INT/EXT_SEL_CH0: IC16.46(IOB_0a) ; port INT/EXT_SEL_CH0
INT/EXT_SEL_CH1: IC16.45(IOB_5b) ; port INT/EXT_SEL_CH1
LDACn_CH0: IC16.43(IOT_49a) ; port LDACn_CH0  [project net LDACn_0]
LDACn_CH1: IC16.38(IOT_50b) ; port LDACn_CH1  [project net LDACn_1]
PPS: IC16.44(IOB_3b_G6) ; port PPS
RESETn_I: IC16.18(IOB_31b) ; port RESETn_I  [project net RESETn]
TIME: IC16.35(IOT_46b_G0) ; port TIME
TRIG: IC16.34(IOT_44b) ; port TRIG
V_LIM_CH0: IC16.48(IOB_4a) ; port V_LIM_CH0
V_LIM_CH1: IC16.47(IOB_2a) ; port V_LIM_CH1
NetD2_1: D2.1(C) IC16.24(VPP_2V5)
NetIC5_2: IC5.2(DQ1) R20.2
NetIC5_3: IC5.3(~{W}/Vpp/DQ2) IC5.7(~{HOLD}/DQ3) R24.2
NetIC5_5: IC5.5(DQ0) R19.2
NetIC16_29: IC16.29(VCCPLL) R18.2

Not connected (* = marked no-connect by the designer): IC4 4(NC); IC16 39(RGB0) 40(RGB1) 41(RGB2); J3 5

### Notes on the sheet
- Project/Equipment
- Document
- Designer
- Drawn by
- Check.by
- Contact
- File
- Last Mod.
- Print Date
- Sheet
- Size
- A3
- of
- Rev
- (in symbol ICE40UP5K-SG48I, part A) BANK 0
- (in symbol ICE40UP5K-SG48I, part B) BANK 1
- (in symbol ICE40UP5K-SG48I, part C) BANK 2

### Library data of the parts
C8-C10 C13 C17 C19 = CC0402_100NF_16V_10%_X7R: as C140 on sheet CPLD; Part Number: CC0402_100NF_16V_10%_X7R; Component Kind: Standard; Component Type: Standard; Pin Count: 2; Value: 100nF; Status: Not Recommended; Manufacturer Part Number: CC0402_100NF_16V_10%_X7R; Case: 0402; Mounted: Yes; Socket: No; SMD: Yes; Sense: No; Manufacturer1 Example: MURATA; Manufacturer1 ComponentHeight: 0.55mm; HelpURL: \\cern.ch\dfs\Applications\Altium\Datasheets\CC0402_X7R_MURATA_GRM.pdf; Author: CERN DEM JLC; CreateDate: 05.12.2013; LatestRevisionDate: 03.12.2007
C12 C14-C16 = CC0402_1UF_16V_10%_X5R: as C2 on sheet CPLD; Part Number: CC0402_1UF_16V_10%_X5R; Component Kind: Standard; Component Type: Standard; Pin Count: 2; Value: 1uF; Status: Preferred; Manufacturer Part Number: CC0402_1UF_16V_10%_X5R; Case: 0402; Mounted: Yes; Socket: No; SMD: Yes; Sense: No; Manufacturer1 Example: TDK; Manufacturer1 ComponentHeight: 0.55mm; HelpURL: \\cern.ch\dfs\Applications\Altium\Datasheets\CC0402_X5R_TDK_C.pdf; Author: CERN DEM JLC; CreateDate: 25.10.2012; LatestRevisionDate: 25.10.2012
D2 = CDBU0520-HF: Schottky Diode; Part Description: 20V Surface mount Schottky Barrier Diode; Manufacturer: COMCHIP; Voltage: 20V; Power: 500mA; PressFit: No; Bonding: No; Part Number: CDBU0520-HF; Component Kind: Standard; Component Type: Standard; Device: CDBU0520-HF; PackageDescription: Small Outline Diode Flat Lead (SOD-523F), Body; 1.80mm L X 1mm W X 0.85mm H; Manufacturer Part Number: CDBU0520-HF; Pin Count: 2; Case: SOD-523F; Mounted: Yes; Socket: No; SMD: Yes; Sense: No; ComponentHeight: 1mm; HelpURL: \\cern.ch\dfs\Applications\Altium\Datasheets\CDBU0520-HF.pdf; Author: CERN DEM HF; CreateDate: 13.10.2023; LatestRevisionDate: 13.10.2023
IC4 = REG_AP2112K-1.2: 600mA CMOS Low Dropout Linear Regulator with Enable; Part Description: 1.2V 600mA CMOS Low Dropout Linear Regulator with Enable; Manufacturer: DIODES INCORPORATED; PressFit: No; Bonding: No; Part Number: AP2112K-1.2TRG1; Component Kind: Standard; Component Type: Standard; Device: AP2112K-1.2TRG1; PackageDescription: SOT23, 0.95mm Pitch; 5 Pin, 1.6mm W X 3.0mm L X 1.40mm H body, IPC Medium Density; Manufacturer Part Number: AP2112K-1.2TRG1; Pin Count: 5; Case: SOT25; Mounted: Yes; Socket: No; SMD: Yes; Sense: No; ComponentHeight: 1.4mm; HelpURL: \\cern.ch\dfs\Applications\Altium\Datasheets\AP2112K-3.3TRG1.pdf; Author: GK; CreateDate: 13.12.2017; LatestRevisionDate: 27.06.2022
IC5 = N25Q032A13ESCA0: 32Mb, 3V, Multiple I/O Serial Flash Memory; Part Description: 32Mb, 2.7 to 3.6V, Multiple I/O Serial Flash Memory; Manufacturer: MICRON TECHNOLOGY; PressFit: No; Bonding: No; Part Number: N25Q032A13ESCA0; Component Kind: Standard; Component Type: Standard; Device: N25Q032A13ESCA0; PackageDescription: SOIC, 1.27mm Pitch; 8 Pin - Body 4x5mm, IPC Medium Density; Manufacturer Part Number: N25Q032A13ESCA0; Pin Count: 8; Case: SOIC8; Mounted: Yes; Socket: No; SMD: Yes; Sense: No; ComponentHeight: 1.75mm; HelpURL: \\cern.ch\dfs\Applications\Altium\Datasheets\N25Q032A13ESCA0.pdf; Author: CERN DEM HF; CreateDate: 09.12.2024; LatestRevisionDate: 09.12.2024
IC6 = MIC803-29D4VM3: 3.075V Microprocessor Supervisor Circuit With Open-Drain Reset Output; Part Description: 2.93V Microprocessor Supervisor Circuit with Open-Drain Reset Output; Manufacturer: MICROCHIP TECHNOLOGY; PressFit: No; Bonding: No; Part Number: MIC803-29D4VM3; Component Kind: Standard; Component Type: Standard; Device: MIC803-29D4VM3; PackageDescription: SOT, 0.95mm Pitch; 3 Pin, 1.30mm W X 2.92mm L X 1.12mm H body, IPC Medium Density; Manufacturer Part Number: MIC803-29D4VM3; Pin Count: 3; Case: SOT23-3; Mounted: Yes; Socket: No; SMD: Yes; Sense: No; ComponentHeight: 1.12mm; Author: CERN DEM BC; HelpURL: \\cern.ch\dfs\Applications\Altium\Datasheets\MIC803.pdf; CreateDate: 29.04.2020; LatestRevisionDate: 29.04.2020
IC16 = ICE40UP5K-SG48I: ICE40 Ultra FPGA, 3520 Logic Cells, 400 kHz Data Transfer Speed, 48 pin QFN; Part Description: ICE40 Ultra FPGA, 5280 Logic Cells, 400 kHz Data Transfer Speed, 48 pin QFN; Manufacturer: LATTICE SEMICONDUCTOR; PressFit: No; Bonding: No; Part Number: ICE40UP5K-SG48I; Component Kind: Standard; Component Type: Standard; Device: ICE40UP5K-SG48I; PackageDescription: QFN, 0.50mm Pitch, Square; 48 Pin, 7.00mm L X 7.00mm W X 1.00mm H body (w/Thermal Tab 5.50mm X 5.40mm), IPC Medium Density; Manufacturer Part Number: ICE40UP5K-SG48I; Pin Count: 49; Case: QFN48; Mounted: Yes; Socket: No; SMD: Yes; Sense: No; ComponentHeight: 1.00mm; HelpURL: \\cern.ch\dfs\Applications\Altium\Datasheets\ICE40UP5K.pdf; ComponentLink1URL: \\cern.ch\dfs\Applications\Altium\Datasheets\LATTICE_Packege.pdf; ComponentLink1Description: Package; ComponentLink2URL: \\cern.ch\dfs\Applications\Altium\Datasheets\ICE40UP5K_Pinout.xlsx; ComponentLink2Description: Pinout; Author: CERN DEM HF; CreateDate: 12/16/2024; LatestRevisionDate: 12/16/2024
J3 = TC2050-IDC: TC2030-MCP and TC2050-IDC Pad Contact; Part Description: 10 X 31mil Diameter SMD Pad For TC2050-IDC Legged Connector; Mounted: No; Part Number: TC2050-IDC; Component Kind: Standard (No BOM); Component Type: Standard (No BOM); Pin Count: 10; Family: TC2050-IDC; Socket: No; SMD: Yes; Sense: No; Status: None; ComponentHeight: 0mm; HelpURL: \\cern.ch\dfs\Applications\Altium\Datasheets\TC2050-IDC.pdf; Author: CERN DEM HF; CreateDate: 02.05.2024; LatestRevisionDate: 02.05.2024; PackageDescription: 10 X 31mil Diameter SMD Pad For TC2030-MCP Legged Connector
OSC1 = OSC_50MHZ_EPSON_SG-310SCN: Oscillator 4 pins 1=\ST 2=GND 3=OUT 4=VCC; Part Description: 3.3V, ±100ppm, 15pF -40..85°C, Stanby Function , Surface Mount Crystal Oscillator (SG-310 Series); Manufacturer: EPSON TOYOCOM; Manufacturer Part Number: SG-310 SCN 50.0000MJ; PressFit: No; Bonding: No; Part Number: OSC_50MHZ_EPSON_SG-310SCN; Component Kind: Standard; Component Type: Standard; PackageDescription: Oscillator, Corner Concave; 4 Pin, 2.5mm L X 3.2mm W X 1.2mm H; Value: 50MHz; Pin Count: 4; Mounted: Yes; Socket: No; SMD: Yes; Sense: No; ComponentHeight: 1.2mm; HelpURL: \\cern.ch\dfs\Applications\Altium\Datasheets\OSC_EPSON_SG-310.pdf; ComponentLink1URL: \\cern.ch\dfs\Applications\Altium\Datasheets\OSC_EPSON_SG-310_Ordering-Informations.pdf; ComponentLink1Description: Ordering Informations; Author: CERN DEM JLC; CreateDate: 31.03.2010; LatestRevisionDate: 31.03.2010
R18 = R0402_100R_0.1%_0.063W_25PPM: Resistor - 0.1%; Part Description: Thin Film Precision Resistor; Manufacturer: GENERIC; Manufacturer1 Part Number: CPF0402B100RE1; Power: 0.063W; TC: ±25ppm/°C; PressFit: No; Part Number: R0402_100R_0.1%_0.063W_25PPM; Component Kind: Standard; Component Type: Standard; Pin Count: 2; Value: 100; Status: Not Recommended; Manufacturer Part Number: R0402_100R_0.1%_0.063W_25PPM; Case: 0402; Mounted: Yes; Sense: No; Socket: No; SMD: Yes; Manufacturer1 Example: TE CONNECTIVITY; Manufacturer1 ComponentHeight: 0.35mm; HelpURL: \\cern.ch\dfs\Applications\Altium\Datasheets\R0402_TYCO_CPF.pdf; Author: CERN DEM JMW; CreateDate: 22.09.2015; LatestRevisionDate: 22.09.2015
R19 R20 = R0402_0R_JUMPER: Resistor; Part Description: 1A (0.05R Max DC Resistance) Zero Ohm Jumper; Manufacturer: GENERIC; Manufacturer1 Part Number: 232270591001L; PressFit: No; Part Number: R0402_0R_JUMPER; Component Kind: Standard; Component Type: Standard; Pin Count: 2; Value: 0; Status: Not Recommended; Manufacturer Part Number: R0402_0R_JUMPER; Case: 0402; Mounted: Yes; Sense: No; Socket: No; SMD: Yes; Manufacturer1 Example: YAGEO PHYCOMP; Manufacturer1 ComponentHeight: 0.4mm; HelpURL: \\cern.ch\dfs\Applications\Altium\Datasheets\R0402_Phycomp_RC0402.pdf; Author: CERN DEM JLC; CreateDate: 03.12.2007; LatestRevisionDate: 17.10.2012
R21 R23-R25 = R0402_10K_0.1%_0.063W_25PPM: Resistor - 0.1%; Part Description: Thin Film Precision Resistor; Manufacturer: GENERIC; Manufacturer1 Part Number: CPF0402B10KE1; Power: 0.063W; TC: ±25ppm/°C; PressFit: No; Part Number: R0402_10K_0.1%_0.063W_25PPM; Component Kind: Standard; Component Type: Standard; Pin Count: 2; Value: 10k; Status: Not Recommended; Manufacturer Part Number: R0402_10K_0.1%_0.063W_25PPM; Case: 0402; Mounted: Yes; Sense: No; Socket: No; SMD: Yes; Manufacturer1 Example: TE CONNECTIVITY; Manufacturer1 ComponentHeight: 0.35mm; HelpURL: \\cern.ch\dfs\Applications\Altium\Datasheets\R0402_TYCO_CPF.pdf; Author: CERN DEM JMW; CreateDate: 9/22/2015; LatestRevisionDate: 9/22/2015

## Sheet DAC_ADC.SchDoc: DAC ADC
size A3; Author: M.Beldyga; CompanyName: WUT ISE; DrawnBy: M.Beldyga; Organization: WUT ISE; Address1: PW ISE; Address2: Nowowiejska 15/19 00-665 Warsaw; Address3: micbeldyga@gmail.com; SheetNumber: 5; SheetTotal: 9; ModifiedBy: -; CheckedDate: -; DivGrp: WUT ISE; Designer: M.Beldyga; ModifiedDate: -; ProjectName: Sensor Box
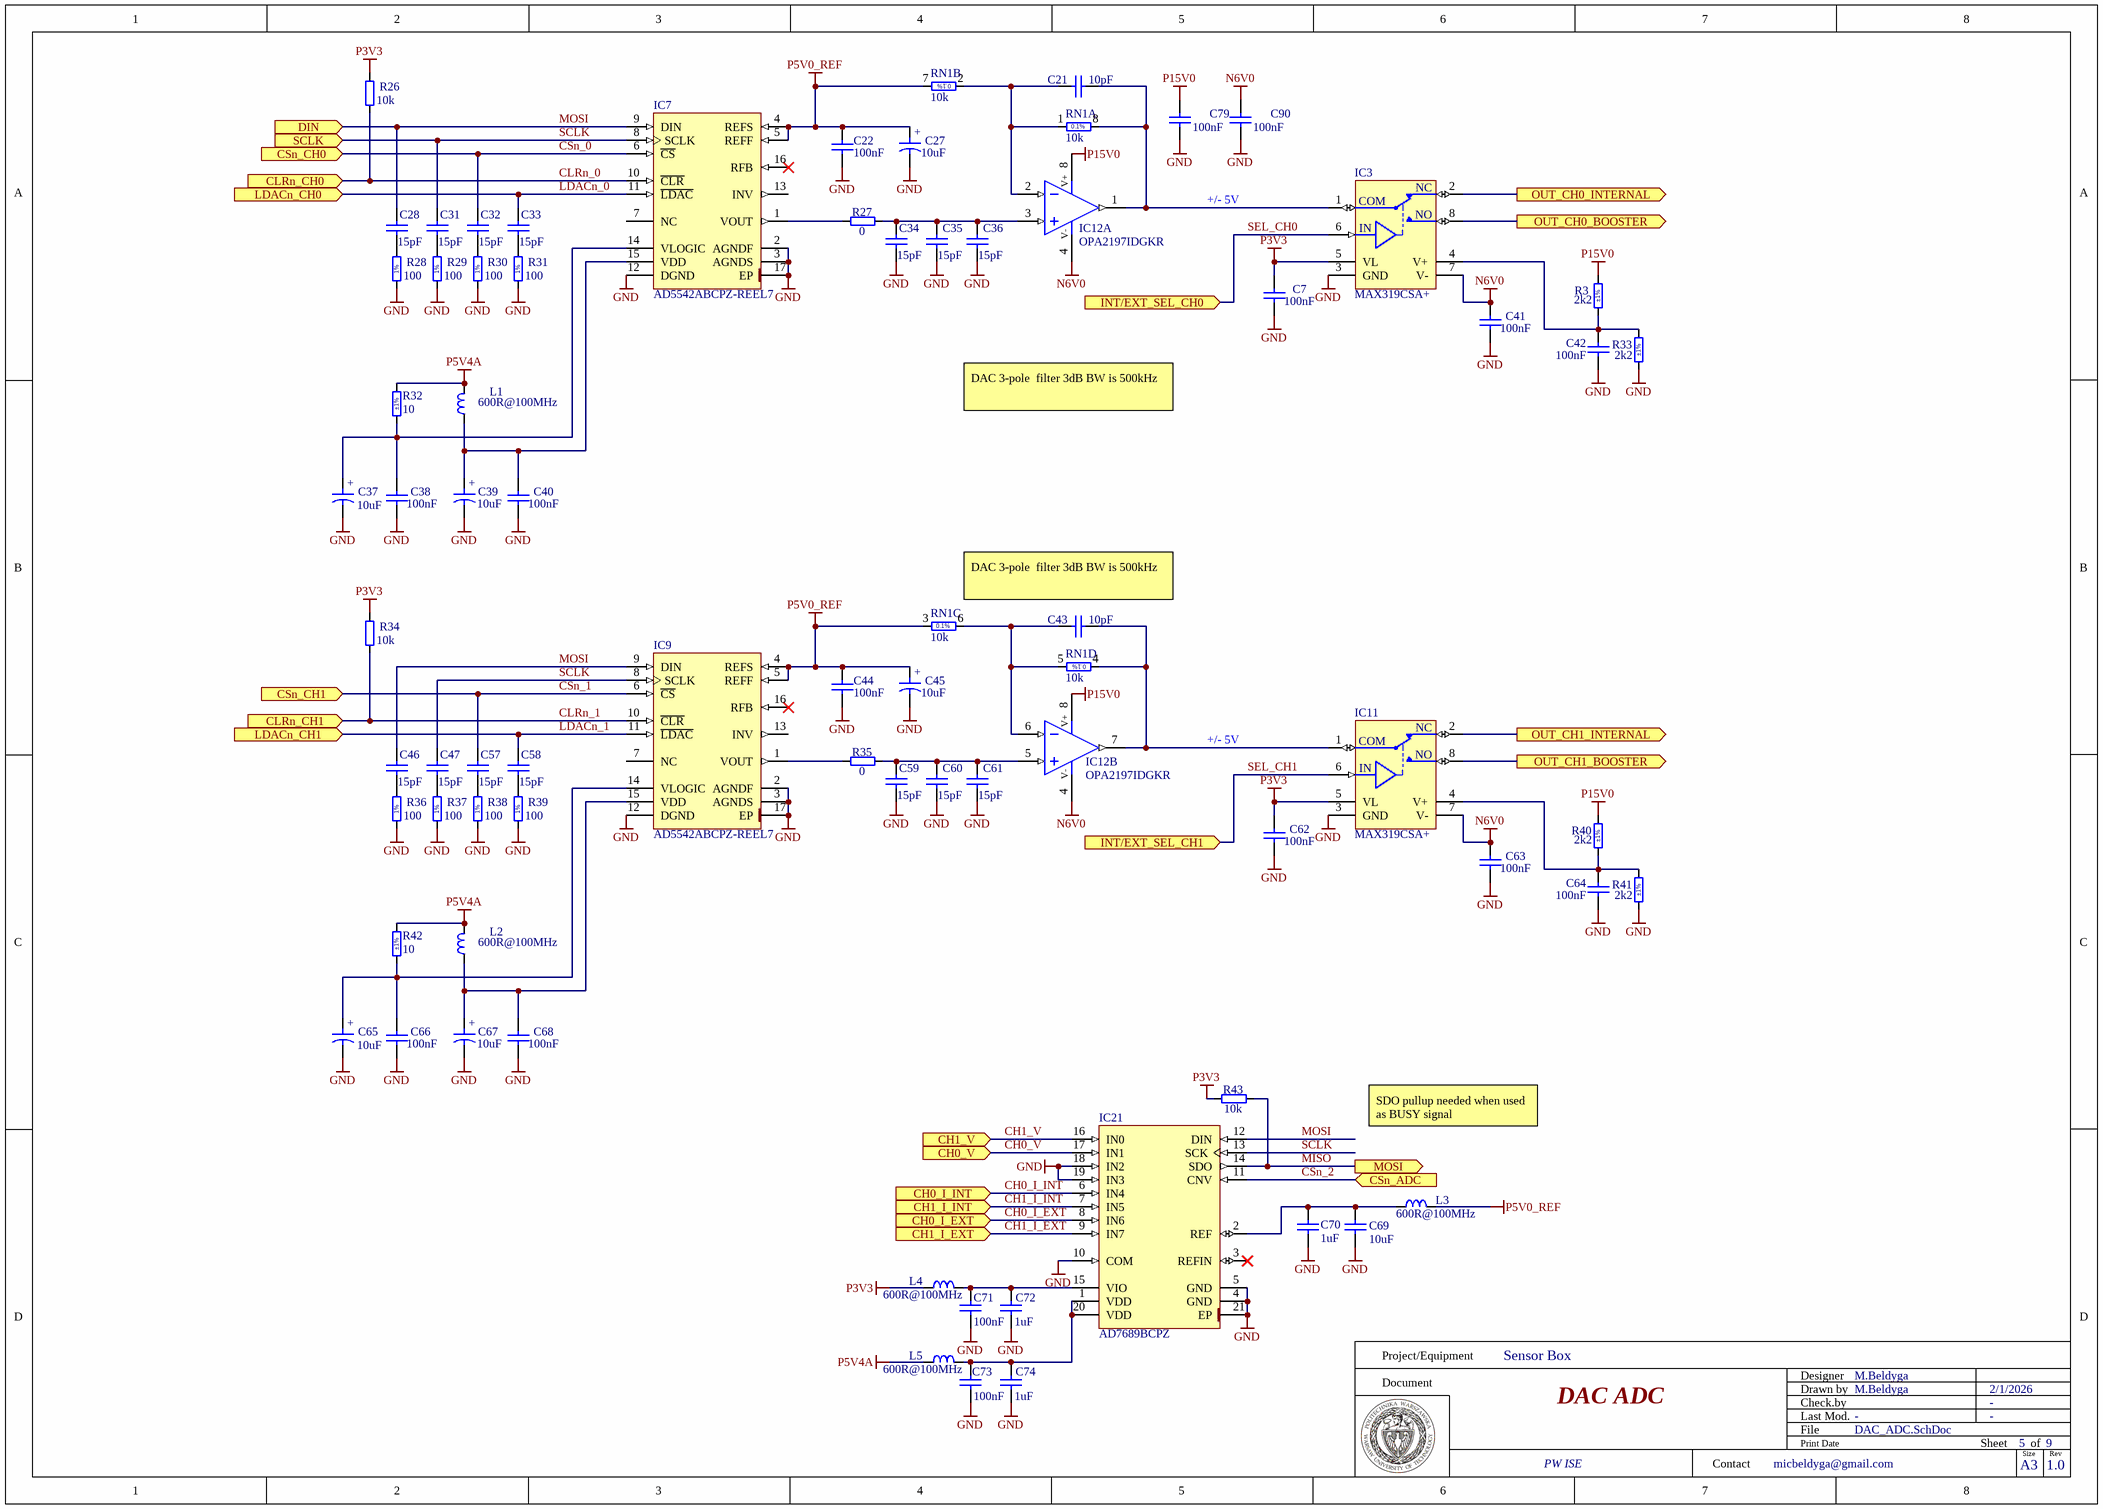
[diagram p4: DAC_ADC.SchDoc]

### Parts
C7  100nF  [CAPC1005X55N]
C21  10pF  [CAPC1005X55N]
C22  100nF  [CAPC1005X55N]
C27  10uF  [CAPMP3216X180N]
C28  15pF  [CAPC1005X55N]
C31  15pF  [CAPC1005X55N]
C32  15pF  [CAPC1005X55N]
C33  15pF  [CAPC1005X55N]
C34  15pF  [CAPC1005X55N]
C35  15pF  [CAPC1005X55N]
C36  15pF  [CAPC1005X55N]
C37  10uF  [CAPMP3216X180N]
C38  100nF  [CAPC1005X55N]
C39  10uF  [CAPMP3216X180N]
C40  100nF  [CAPC1005X55N]
C41  100nF  [CAPC1005X55N]
C42  100nF  [CAPC1005X55N]
C43  10pF  [CAPC1005X55N]
C44  100nF  [CAPC1005X55N]
C45  10uF  [CAPMP3216X180N]
C46  15pF  [CAPC1005X55N]
C47  15pF  [CAPC1005X55N]
C57  15pF  [CAPC1005X55N]
C58  15pF  [CAPC1005X55N]
C59  15pF  [CAPC1005X55N]
C60  15pF  [CAPC1005X55N]
C61  15pF  [CAPC1005X55N]
C62  100nF  [CAPC1005X55N]
C63  100nF  [CAPC1005X55N]
C64  100nF  [CAPC1005X55N]
C65  10uF  [CAPMP3216X180N]
C66  100nF  [CAPC1005X55N]
C67  10uF  [CAPMP3216X180N]
C68  100nF  [CAPC1005X55N]
C69  10uF  [CAPC1608X80N]
C70  1uF  [CAPC1608X87N]
C71  100nF  [CAPC1005X55N]
C72  1uF  [CAPC1608X87N]
C73  100nF  [CAPC1005X55N]
C74  1uF  [CAPC1608X87N]
C79  100nF  [CAPC1005X55N]
C90  100nF  [CAPC1005X55N]
IC3  MAX319CSA+  [SOIC127P600X175-8N]
IC7  AD5542ABCPZ-REEL7  [QFN50P300X300X80-17N-S175]
IC9  AD5542ABCPZ-REEL7  [QFN50P300X300X80-17N-S175]
IC11  MAX319CSA+  [SOIC127P600X175-8N]
IC12  OPA2197IDGKR  [SOP65P490X110-8N]  (parts A,B of 2)
IC21  AD7689BCPZ  [QFN50P400X400X80-21N-S265]
L1  600R@100MHz  [INDC1005X55N]
L2  600R@100MHz  [INDC1005X55N]
L3  600R@100MHz  [INDC1005X55N]
L4  600R@100MHz  [INDC1005X55N]
L5  600R@100MHz  [INDC1005X55N]
R3  2k2  Tolerance: ±1%  [RESC1005X40N]
R26  10k  [RESC1005X35N]
R27  0  [RESC1005X40N]
R28  100  [RESC1005X40N]
R29  100  [RESC1005X40N]
R30  100  [RESC1005X40N]
R31  100  [RESC1005X40N]
R32  10  Tolerance: ±1%  [RESC1005X40N]
R33  2k2  Tolerance: ±1%  [RESC1005X40N]
R34  10k  [RESC1005X35N]
R35  0  [RESC1005X40N]
R36  100  [RESC1005X40N]
R37  100  [RESC1005X40N]
R38  100  [RESC1005X40N]
R39  100  [RESC1005X40N]
R40  2k2  Tolerance: ±1%  [RESC1005X40N]
R41  2k2  Tolerance: ±1%  [RESC1005X40N]
R42  10  Tolerance: ±1%  [RESC1005X40N]
R43  10k  [RESC1005X35N]
RN1  10k  [SOIC127P600X175-8N]  (parts A,B,C,D of 4)

### Ports
CH0_I_EXT (in), CH0_I_INT (in), CH0_V (in), CH1_I_EXT (in), CH1_I_INT (in), CH1_V (in), CLRn_CH0 (in), CLRn_CH1 (in), CSn_ADC (in), CSn_CH0 (in), CSn_CH1 (in), DIN (in), INT/EXT_SEL_CH0 (in), INT/EXT_SEL_CH1 (in), LDACn_CH0 (in), LDACn_CH1 (in), MOSI (out), OUT_CH0_BOOSTER (out), OUT_CH0_INTERNAL (out), OUT_CH1_BOOSTER (out), OUT_CH1_INTERNAL (out), SCLK (in)

### Nets
GND: C7.1 C22.1 C27.2 C34.1 C35.1 C36.1 C37.2 C38.1 C39.2 C40.1 C41.1 C42.1 C44.1 C45.2 C59.1 C60.1 C61.1 C62.1 C63.1 C64.1 C65.2 C66.1 C67.2 C68.1 C69.1 C70.1 C71.1 C72.1 C73.1 C74.1 C79.1 C90.1 IC3.3(GND) IC7.2(AGNDF) IC7.3(AGNDS) IC7.12(DGND) IC7.17(EP) IC9.2(AGNDF) IC9.3(AGNDS) IC9.12(DGND) IC9.17(EP) IC11.3(GND) IC21.4(GND) IC21.5(GND) IC21.10(COM) IC21.18(IN2) IC21.19(IN3) IC21.21(EP) R28.1 R29.1 R30.1 R31.1 R33.1 R36.1 R37.1 R38.1 R39.1 R41.1
N6V0: C41.2 C63.2 C90.2 IC3.7(V-) IC11.7(V-) IC12.4(V-)
P3V3: C7.2 C62.2 IC3.5(VL) IC11.5(VL) L4.1 R26.2 R34.2 R43.1
P5V0_REF: C22.2 C27.1 C44.2 C45.1 IC7.4(REFS) IC7.5(REFF) IC9.4(REFS) IC9.5(REFF) L3.1 RN1.3 RN1.7
P5V4A: L1.2 L2.2 L5.1 R32.2 R42.2
P15V0: C79.2 IC12.8(V+) R3.2 R40.2
CH0_I_EXT: IC21.8(IN6) ; port CH0_I_EXT  [project net CH0_ADC_I_EXT]
CH0_I_INT: IC21.6(IN4) ; port CH0_I_INT  [project net CH0_ADC_I_INT]
CH0_V: IC21.17(IN1) ; port CH0_V  [project net CH0_ADC_V]
CH1_I_EXT: IC21.9(IN7) ; port CH1_I_EXT  [project net CH1_ADC_I_EXT]
CH1_I_INT: IC21.7(IN5) ; port CH1_I_INT  [project net CH1_ADC_I_INT]
CH1_V: IC21.16(IN0) ; port CH1_V  [project net CH1_ADC_V]
CLRn_0: IC7.10(~{CLR}) R26.1 ; port CLRn_CH0
CLRn_1: IC9.10(~{CLR}) R34.1 ; port CLRn_CH1
CSn_0: C32.2 IC7.6(~{CS}) ; port CSn_CH0
CSn_1: C57.2 IC9.6(~{CS}) ; port CSn_CH1
CSn_2: IC21.11(CNV) ; port CSn_ADC
LDACn_0: C33.2 IC7.11(~{LDAC}) ; port LDACn_CH0
LDACn_1: C58.2 IC9.11(~{LDAC}) ; port LDACn_CH1
MISO: IC21.14(SDO) R43.2 ; port MOSI  [project net ADC/DAC_MISO]
MOSI: C28.2 C46.2 IC7.9(DIN) IC9.9(DIN) IC21.12(DIN) ; port DIN  [project net ADC/DAC_MOSI]
SCLK: C31.2 C47.2 IC7.8(SCLK) IC9.8(SCLK) IC21.13(SCK) ; port SCLK  [project net ADC/DAC_SCLK]
SEL_CH0: IC3.6(IN) ; port INT/EXT_SEL_CH0  [project net INT/EXT_SEL_CH0]
SEL_CH1: IC11.6(IN) ; port INT/EXT_SEL_CH1  [project net INT/EXT_SEL_CH1]
V_CTRL: IC3.2(NC) ; port OUT_CH0_INTERNAL
V_CTRL: IC11.2(NC) ; port OUT_CH1_INTERNAL  [a separate net that carries the same name]
NetC21_1: C21.1 IC12.2(IN-) RN1.1 RN1.2
NetC21_2: C21.2 IC3.1(S) IC12.1(OUT) RN1.8
NetC28_1: C28.1 R28.2
NetC31_1: C31.1 R29.2
NetC32_1: C32.1 R30.2
NetC33_1: C33.1 R31.2
NetC34_2: C34.2 C35.2 C36.2 IC12.3(IN+) R27.2
NetC37_1: C37.1 C38.2 IC7.14(VLOGIC) R32.1
NetC39_1: C39.1 C40.2 IC7.15(VDD) L1.1
NetC42_2: C42.2 IC3.4(V+) R3.1 R33.2
NetC43_1: C43.1 IC12.6(IN-) RN1.5 RN1.6
NetC43_2: C43.2 IC11.1(S) IC12.7(OUT) RN1.4
NetC46_1: C46.1 R36.2
NetC47_1: C47.1 R37.2
NetC57_1: C57.1 R38.2
NetC58_1: C58.1 R39.2
NetC59_2: C59.2 C60.2 C61.2 IC12.5(IN+) R35.2
NetC64_2: C64.2 IC11.4(V+) R40.1 R41.2
NetC65_1: C65.1 C66.2 IC9.14(VLOGIC) R42.1
NetC67_1: C67.1 C68.2 IC9.15(VDD) L2.1
NetC69_2: C69.2 C70.2 IC21.2(REF) L3.2
NetC71_2: C71.2 C72.2 IC21.15(VIO) L4.2
NetC73_2: C73.2 C74.2 IC21.1(VDD) IC21.20(VDD) L5.2
NetIC3_8: IC3.8(NO) ; port OUT_CH0_BOOSTER
NetIC7_1: IC7.1(VOUT) R27.1
NetIC9_1: IC9.1(VOUT) R35.1
NetIC11_8: IC11.8(NO) ; port OUT_CH1_BOOSTER

Not connected (* = marked no-connect by the designer): IC7 7(NC) 13(INV) 16(RFB)*; IC9 7(NC) 13(INV) 16(RFB)*; IC21 3(REFIN)*

### Notes on the sheet
- +/- 5V
- DAC 3-pole  filter 3dB BW is 500kHz
- SDO pullup needed when used as BUSY signal
- Project/Equipment
- Document
- Designer
- Drawn by
- Check.by
- Contact
- File
- Last Mod.
- Print Date
- Sheet
- Size
- A3
- of
- Rev
- (in symbol CTE3216-18_10UF_16V_20%_AVX_TCJ) +
- (in symbol MAX319CSA+) COM
- (in symbol R0402_100R_1%_0.0625W_100PPM) 1%
- (in symbol RN_10K_VISHAY_AORN1002A, part A) 0.1%
- (in symbol RN_10K_VISHAY_AORN1002A, part B) 0.1%
- (in symbol RN_10K_VISHAY_AORN1002A, part C) 0.1%
- (in symbol RN_10K_VISHAY_AORN1002A, part D) 0.1%

### Library data of the parts
C7 C22 C38 C40-C42 C44 C62-C64 C66 C68 C71 C73 C79 C90 = CC0402_100NF_16V_10%_X5R: Non-polarised capacitor; Part Description: SMD Multilayer Chip Ceramic Capacitor; Manufacturer: GENERIC; Manufacturer1 Part Number: GRM155R61C104KA88D; Voltage: 16V; TC: X5R; Tolerance: ±10%; Part Number: CC0402_100NF_16V_10%_X5R; Component Kind: Standard; Component Type: Standard; Pin Count: 2; Value: 100nF; Status: None; Manufacturer Part Number: CC0402_100NF_16V_10%_X5R; Case: 0402; Mounted: Yes; Socket: No; SMD: Yes; Sense: No; Manufacturer1 Example: MURATA; Manufacturer1 ComponentHeight: 0.55mm; HelpURL: \\cern.ch\dfs\Applications\Altium\Datasheets\CC0402_X5R_MURATA_GRM.pdf; Author: CERN DEM JLC; CreateDate: 10.12.2013; LatestRevisionDate: 10.12.2013
C21 C43 = CC0402_10PF_50V_5%_C0G: Non-polarised capacitor; Part Description: SMD Multilayer Chip Ceramic Capacitor; Manufacturer: GENERIC; Manufacturer1 Part Number: C0402C100J5GACTU; Voltage: 50V; TC: C0G/NP0; Tolerance: ±5%; Part Number: CC0402_10PF_50V_5%_C0G; Component Kind: Standard; Component Type: Standard; Pin Count: 2; Value: 10pF; Status: Preferred; Manufacturer Part Number: CC0402_10PF_50V_5%_C0G; Case: 0402; Mounted: Yes; Socket: No; SMD: Yes; Sense: No; Manufacturer1 Example: KEMET; Manufacturer1 ComponentHeight: 0.55mm; HelpURL: \\cern.ch\dfs\Applications\Altium\Datasheets\CC0805_C0G_KEMET_(Commercial Grade).pdf; Author: CERN DEM JLC; CreateDate: 03.12.2007; LatestRevisionDate: 22.04.2015
C27 C37 C39 C45 C65 C67 = CTE3216-18_10UF_16V_20%_AVX_TCJ: Polarised capacitor; Part Description: ESR 0R200 Tantalum Solid Electrolytic Chip Capacitor with Conductive Polymer Electrode; Manufacturer: AVX; Manufacturer Part Number: TCJA106M016R0200 or  or TR3A106K016C1700; Manufacturer1 Part Number: TCJA106M016R0200; Voltage: 16V; Tolerance: ±20%; Part Number: CTE3216-18_10UF_16V_20%_AVX_TCJ; Component Kind: Standard; Component Type: Standard; Pin Count: 2; Value: 10uF; Status: Preferred; Case: A; Mounted: Yes; Socket: No; SMD: Yes; Sense: No; HelpURL: \\cern.ch\dfs\Applications\Altium\Datasheets\CTE_AVX_TCJ.pdf; Author: CERN DEM JLC; CreateDate: 29.03.2012; LatestRevisionDate: 29.03.2012; ComponentHeight: 1.8mm
C28 C31-C36 C46 C47 C57-C61 = CC0402_15PF_50V_5%_C0G: Non-polarised capacitor; Part Description: SMD Multilayer Chip Ceramic Capacitor; Manufacturer: GENERIC; Manufacturer1 Part Number: C0402C150J5GACTU; Voltage: 50V; TC: C0G/NP0; Tolerance: ±5%; Part Number: CC0402_15PF_50V_5%_C0G; Component Kind: Standard; Component Type: Standard; Pin Count: 2; Value: 15pF; Status: Preferred; Manufacturer Part Number: CC0402_15PF_50V_5%_C0G; Case: 0402; Mounted: Yes; Socket: No; SMD: Yes; Sense: No; Manufacturer1 Example: KEMET; Manufacturer1 ComponentHeight: 0.55mm; HelpURL: \\cern.ch\dfs\Applications\Altium\Datasheets\CC0402_C0G_KEMET_(Commercial Grade).pdf; Author: CERN DEM JLC; CreateDate: 12/3/2007; LatestRevisionDate: 4/22/2015
C69 = CC0603_10UF_16V_20%_X5R: Non-polarised capacitor; Part Description: SMD Multilayer Chip Ceramic Capacitor; Manufacturer: GENERIC; Manufacturer1 Part Number: GRM188R61C106MA73D; Voltage: 16V; TC: X5R; Tolerance: ±20%; Part Number: CC0603_10UF_16V_20%_X5R; Component Kind: Standard; Component Type: Standard; Pin Count: 2; Value: 10uF; Status: None; Manufacturer Part Number: CC0603_10UF_16V_20%_X5R; Case: 0603; Mounted: Yes; Socket: No; SMD: Yes; Sense: No; Manufacturer1 Example: MURATA; Manufacturer1 ComponentHeight: 0.8mm; HelpURL: \\cern.ch\dfs\Applications\Altium\Datasheets\CC0603_X5R_MURATA_GRM.pdf; Author: CERN DEM MR; CreateDate: 02.03.2016; LatestRevisionDate: 02.03.2016
C70 C72 C74 = CC0603_1UF_25V_10%_X7R: Non-polarised capacitor; Part Description: SMD Multilayer Chip Ceramic Capacitor; Manufacturer: GENERIC; Manufacturer1 Part Number: GCM188R71E105KA64D; Voltage: 25V; TC: X7R; Tolerance: ±10%; Part Number: CC0603_1UF_25V_10%_X7R; Component Kind: Standard; Component Type: Standard; Pin Count: 2; Value: 1uF; Status: None; Manufacturer Part Number: CC0603_1UF_25V_10%_X7R; Case: 0603; Mounted: Yes; Socket: No; SMD: Yes; Sense: No; Manufacturer1 Example: MURATA; Manufacturer1 ComponentHeight: 0.9mm; HelpURL: \\cern.ch\dfs\Applications\Altium\Datasheets\CC0603_X7R_MURATA.pdf; Author: CERN DEM JLC; CreateDate: 18.01.2011; LatestRevisionDate: 18.01.2011
IC3 IC11 = MAX319CSA+: Precision, Single SPDT CMOS Analog Switch; Manufacturer: MAXIM; PressFit: No; Bonding: No; Part Number: MAX319CSA+; Component Kind: Standard; Component Type: Standard; Device: MAX319CSA+; PackageDescription: SOIC 8, Pitch 1.27mm, Body 4x5mm, IPC Medium Density; Part Description: Precision, Single SPDT CMOS Analog Switch; Manufacturer Part Number: MAX319CSA; Pin Count: 8; Case: SOIC8; Mounted: Yes; Socket: No; SMD: Yes; Sense: No; ComponentHeight: 1.75mm; Author: CERN DEM JLC; HelpURL: \\cern.ch\dfs\Applications\Altium\Datasheets\MAX319CSA+.pdf; CreateDate: 4/26/2011; LatestRevisionDate: 4/4/2022
IC7 IC9 = AD5542ABCPZ-REEL7: 2.7V to 5.5V, Serial-Input, Voltage-Output, 16-Bit DAC; Manufacturer: ANALOG DEVICES; PressFit: No; Bonding: No; Part Number: AD5542ABCPZ-REEL7; Component Kind: Standard; Component Type: Standard; Device: AD5542ABCPZ-REEL7; PackageDescription: QFN, 0.50mm Pitch, Square; 16 Pin, 3.00mm L X 3.00mm W X 0.80mm H body (w/Thermal Tab 1.75 X 1.75mm), IPC Medium Density; Part Description: 2.7V to 5.5V, Serial-Input, Voltage-Output, 16-Bit DAC; Manufacturer Part Number: AD5542ABCP; Pin Count: 17; Case: QFN16; Mounted: Yes; Socket: No; SMD: Yes; Sense: No; ComponentHeight: 0.8mm; Author: CERN DEM JLC; HelpURL: \\cern.ch\dfs\Applications\Altium\Datasheets\AD5542ABCPZ-REEL7.pdf; CreateDate: 11/29/2018; LatestRevisionDate: 3/23/2022
IC12 = OA_OPA2197IDGKR: 36-V, Precision, Rail-to-Rail Input Output, Low Offset Voltage Op Amp 8-VSSOP; Part Description: High-Precision, Low-Noise, Rail-to-Rail Output,10-MHz Op Amp; Manufacturer1: TEXAS INSTRUMENTS; PressFit: No; Bonding: No; Part Number: OPA2197IDGKR; Component Kind: Standard; Component Type: Standard; Device: OPA2197IDGKR; PackageDescription: SOP, 0.65mm pitch; 8 pin, 3.00mm W X 3.00mm L X 1.10mm H body, IPC Medium Density; Manufacturer1 Part Number: OPA2197IDGKR; Pin Count: 8; Case: MSOP8; Mounted: Yes; Socket: No; SMD: Yes; Sense: No; ComponentHeight: 1.1mm; Author: GK; HelpURL: \\cern.ch\dfs\Applications\Altium\Datasheets\OPA2140AIDGK.pdf; CreateDate: 20.04.2017; LatestRevisionDate: 20.04.2017
IC21 = AD7689BCPZ: 16-Bit, 8-Channel, 250 kSPS PulSAR ADC; Part Description: 16-Bit, ±1.5 LSB INL, 8-Channel, 250 kSPS PulSAR ADC; Manufacturer: ANALOG DEVICES; PressFit: No; Bonding: No; Part Number: AD7689BCPZ; Component Kind: Standard; Component Type: Standard; Device: AD7689BCPZ; PackageDescription: QFN, 0.50mm Pitch, Square; 20 Pin, 4.00mm L X 4.00mm W X 0.80mm H Body (w/Thermal Tab 2.75 X 2.75mm), IPC Medium Density; Manufacturer Part Number: AD7689BCP; Pin Count: 21; Case: QFN20; Mounted: Yes; Socket: No; SMD: Yes; Sense: No; ComponentHeight: 0.8mm; Author: CERN DEM BC; HelpURL: \\cern.ch\dfs\Applications\Altium\Datasheets\AD7689BCPZ.pdf; CreateDate: 3/15/2021; LatestRevisionDate: 3/22/2022
L1-L5 = IND0402_MURATA_BLM15HD601SN1: Inductor; Part Description: SMD EMIFIL Suppression Chip Ferrite Bead; Manufacturer1: MURATA; Manufacturer1 Part Number: BLM15HD601SN1D; Power: 300mA; Resistance: 0.85R; Tolerance: ±25%; Part Number: IND0402_MURATA_BLM15HD601SN1; Component Kind: Standard; Component Type: Standard; Pin Count: 2; Value: 600R@100MHz; Status: None; Case: 0402; Mounted: Yes; Socket: No; SMD: Yes; Sense: No; ComponentHeight: 0.55mm; HelpURL: \\cern.ch\dfs\Applications\Altium\Datasheets\IND0402_MURATA_BLM15H.pdf; Author: CERN DEM JLC; CreateDate: 28/02/2012; LatestRevisionDate: 28/02/2012
R3 R33 R40 R41 = R0402_2K2_1%_0.0625W_100PPM: Resistor - 1%; Part Description: General Purpose Thick Film Chip Resistor; Manufacturer: GENERIC; Manufacturer1 Part Number: 232270672202L; TC: ±100ppm/°C; PressFit: No; Part Number: R0402_2K2_1%_0.0625W_100PPM; Component Kind: Standard; Component Type: Standard; Pin Count: 2; Value: 2k2; Status: Not Recommended; Power: 0.0625W; Manufacturer Part Number: R0402_2K2_1%_0.0625W_100PPM; Case: 0402; Mounted: Yes; Sense: No; Socket: No; SMD: Yes; Manufacturer1 ComponentHeight: 0.4mm; HelpURL: \\cern.ch\dfs\Applications\Altium\Datasheets\R0402_Phycomp_RC0402.pdf; Author: CERN DEM JLC; CreateDate: 12/3/2007; LatestRevisionDate: 10/17/2012; Manufacturer1 Example: YAGEO PHYCOMP
R26 R34 R43 = R0402_10K_0.1%_0.063W_25PPM: as R21 on sheet FPGA; Part Number: R0402_10K_0.1%_0.063W_25PPM; Component Kind: Standard; Component Type: Standard; Pin Count: 2; Value: 10k; Status: Not Recommended; Tolerance: ±0.1%; Manufacturer Part Number: R0402_10K_0.1%_0.063W_25PPM; Case: 0402; Mounted: Yes; Sense: No; Socket: No; SMD: Yes; Manufacturer1 ComponentHeight: 0.35mm; HelpURL: \\cern.ch\dfs\Applications\Altium\Datasheets\R0402_TYCO_CPF.pdf; Author: CERN DEM JMW; CreateDate: 9/22/2015; LatestRevisionDate: 9/22/2015; Manufacturer1 Example: TE CONNECTIVITY
R27 R35 = R0402_0R_JUMPER: Resistor; Part Description: 1A (0.05R Max DC Resistance) Zero Ohm Jumper; Manufacturer: GENERIC; Manufacturer1: Vishay; Manufacturer1 Part Number: CRCW04020000Z0EDC; PressFit: No; Part Number: R0402_0R_JUMPER; Component Kind: Standard; Component Type: Standard; Pin Count: 2; Value: 0; Status: Not Recommended; Manufacturer Part Number: R0402_0R_JUMPER; Case: 0402; Mounted: Yes; Sense: No; Socket: No; SMD: Yes; Manufacturer1 ComponentHeight: 0.4mm; HelpURL: \\cern.ch\dfs\Applications\Altium\Datasheets\R0402_Phycomp_RC0402.pdf; Author: CERN DEM JLC; CreateDate: 03.12.2007; LatestRevisionDate: 17.10.2012
R28-R31 R36-R39 = R0402_100R_1%_0.0625W_100PPM: Resistor - 1%; Part Description: General Purpose Thick Film Chip Resistor; Manufacturer: GENERIC; Manufacturer1: Vishay; Manufacturer1 Part Number: RCA0402100RFKED; TC: ±100ppm/°C; PressFit: No; Part Number: R0402_100R_1%_0.0625W_100PPM; Component Kind: Standard; Component Type: Standard; Pin Count: 2; Value: 100; Status: Not Recommended; Power: 0.0625W; Tolerance: ±1%; Manufacturer Part Number: R0402_100R_1%_0.0625W_100PPM; Case: 0402; Mounted: Yes; Sense: No; Socket: No; SMD: Yes; Manufacturer1 ComponentHeight: 0.4mm; HelpURL: \\cern.ch\dfs\Applications\Altium\Datasheets\R0402_Phycomp_RC0402.pdf; Author: CERN DEM JLC; CreateDate: 03.12.2007; LatestRevisionDate: 17.10.2012
R32 R42 = R0402_10R_1%_0.0625W_200PPM: Resistor - 1%; Part Description: General Purpose Thick Film Chip Resistor; Manufacturer: GENERIC; Manufacturer1 Part Number: 232270671009L; TC: ±200ppm/°C; PressFit: No; Part Number: R0402_10R_1%_0.0625W_200PPM; Component Kind: Standard; Component Type: Standard; Pin Count: 2; Value: 10; Status: Not Recommended; Power: 0.0625W; Manufacturer Part Number: R0402_10R_1%_0.0625W_200PPM; Case: 0402; Mounted: Yes; Sense: No; Socket: No; SMD: Yes; Manufacturer1 Example: YAGEO PHYCOMP; Manufacturer1 ComponentHeight: 0.4mm; HelpURL: \\cern.ch\dfs\Applications\Altium\Datasheets\R0402_Phycomp_RC0402.pdf; Author: CERN DEM JLC; CreateDate: 6/24/2009; LatestRevisionDate: 10/17/2012
RN1 = RN_10K_VISHAY_AORN1002A: DIL8 Resistor Network 4 Isolated Resistor 0.1%; Part Description: Dual-In-Line Thin Film Precision Automotive Resistors Network, (4 Isolated) - AORN Series; Manufacturer: VISHAY DALE; Power: 4x0.1W; TC: ±25ppm/°C; PressFit: No; Part Number: RN_10K_VISHAY_AORN1002A; Component Kind: Standard; Component Type: Standard; Pin Count: 8; Value: 10k; Sense: No; Tolerance: ±0.1%; Manufacturer Part Number: AORN1002A; Case: SOIC8; Mounted: Yes; Socket: No; SMD: Yes; ComponentHeight: 1.73mm; HelpURL: \\cern.ch\dfs\Applications\Altium\Datasheets\RN_VISHAY_AORN.pdf; Author: CERN DEM JLC; CreateDate: 2/20/2017; LatestRevisionDate: 5/3/2017